# Altium schematic sheet smart.SchDoc
size A0
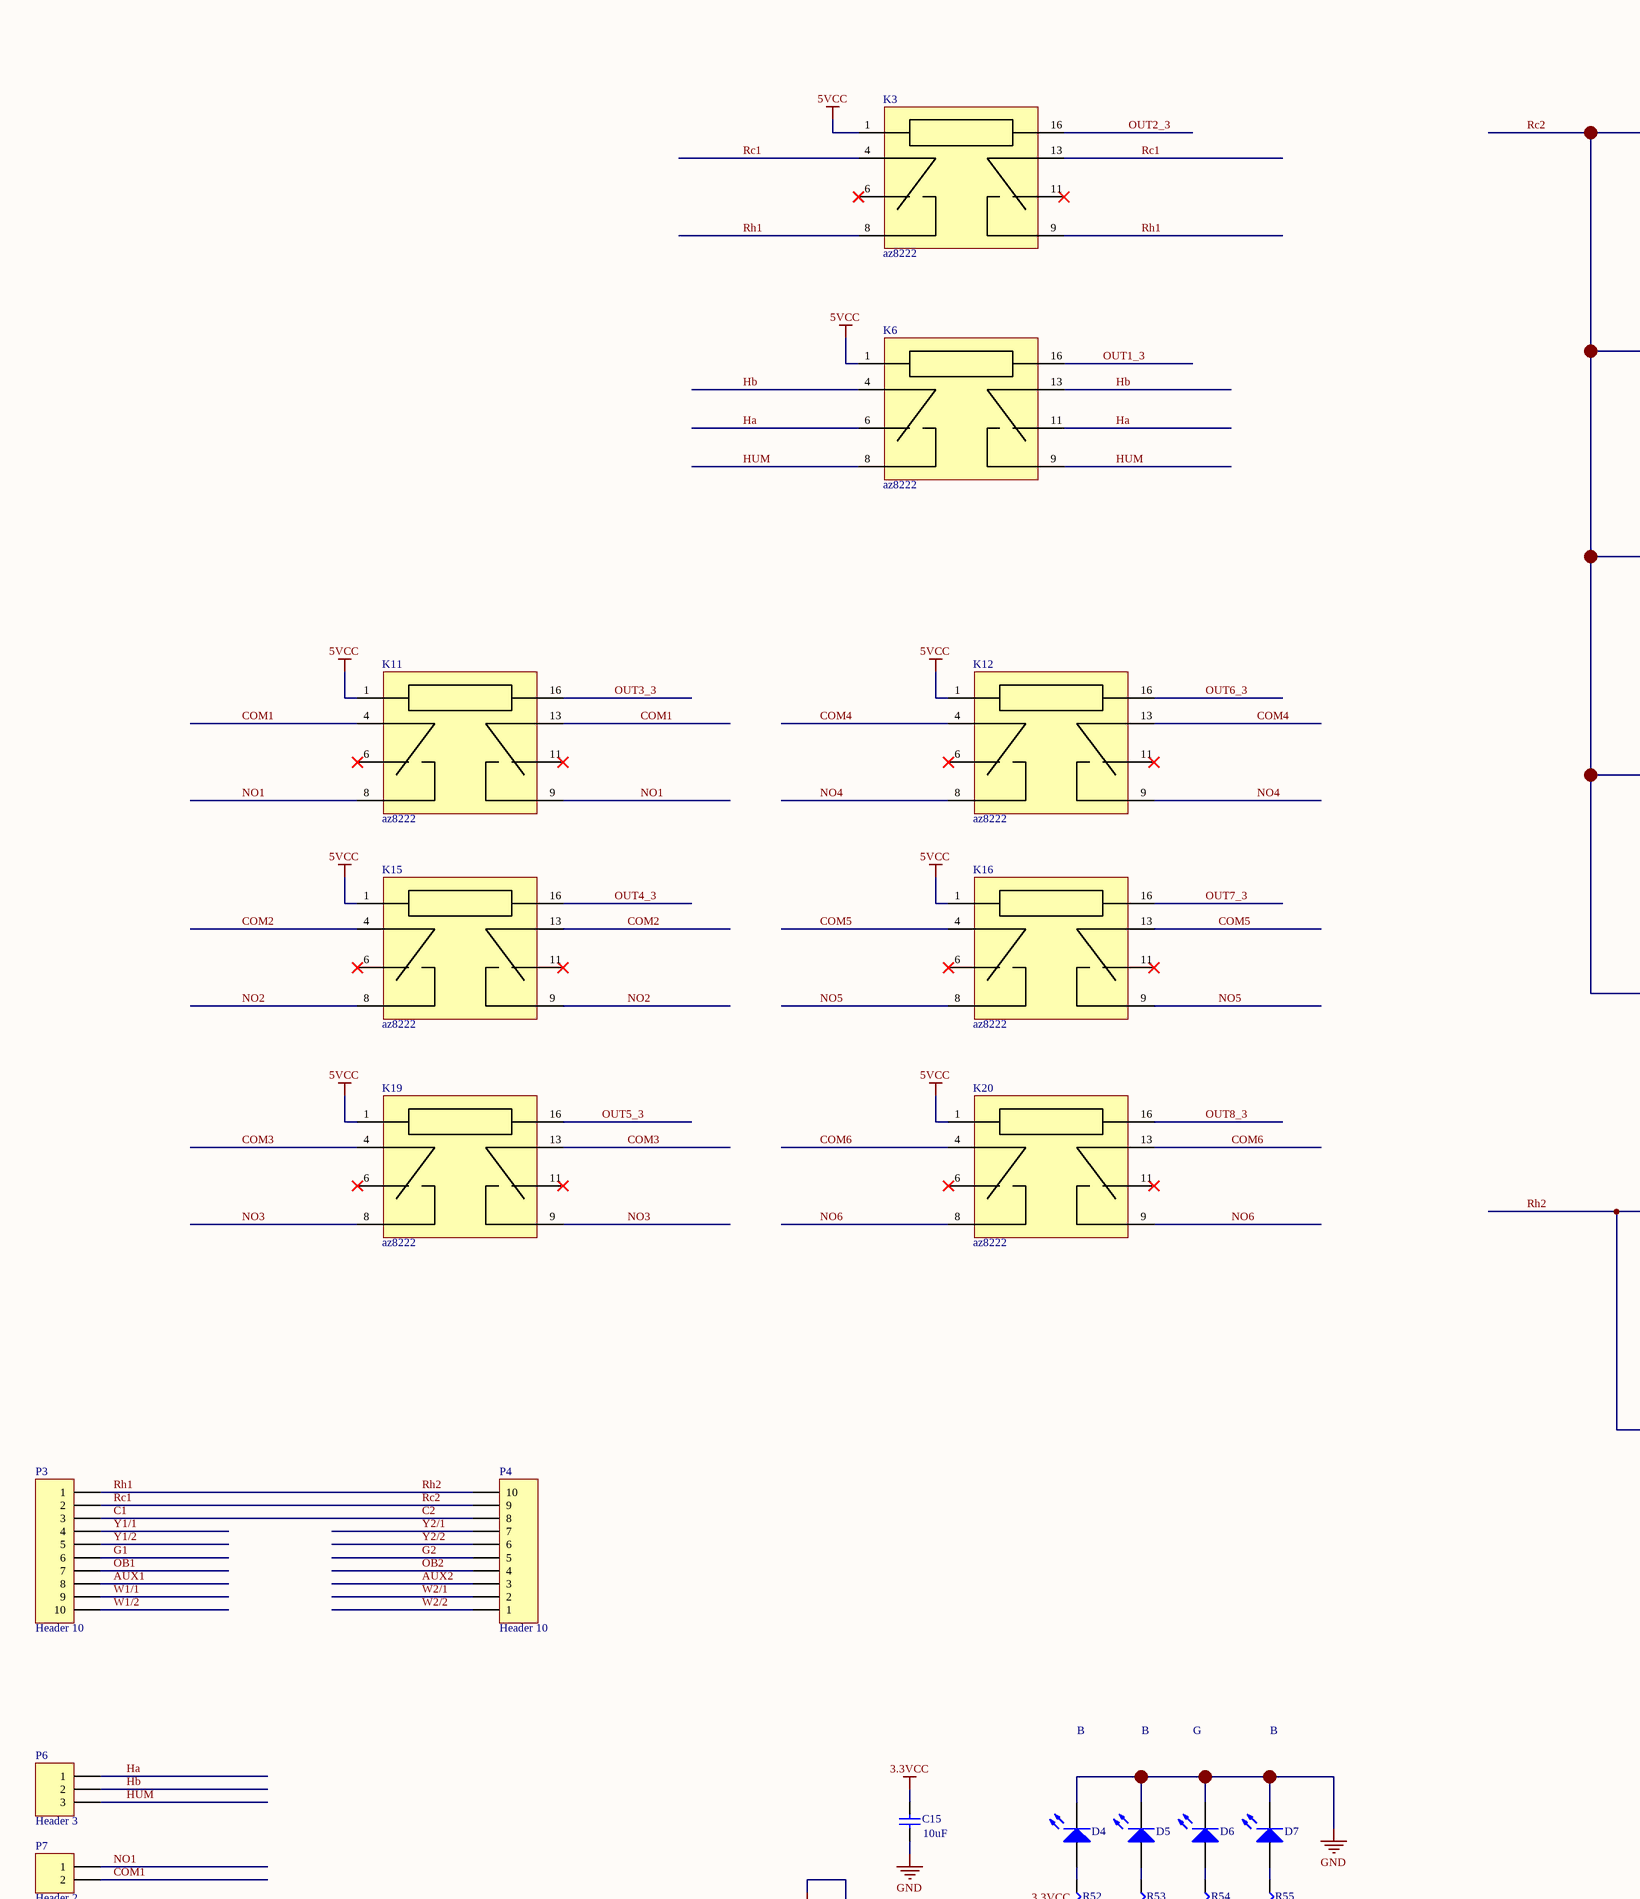
[diagram p0: smart.SchDoc, top left]
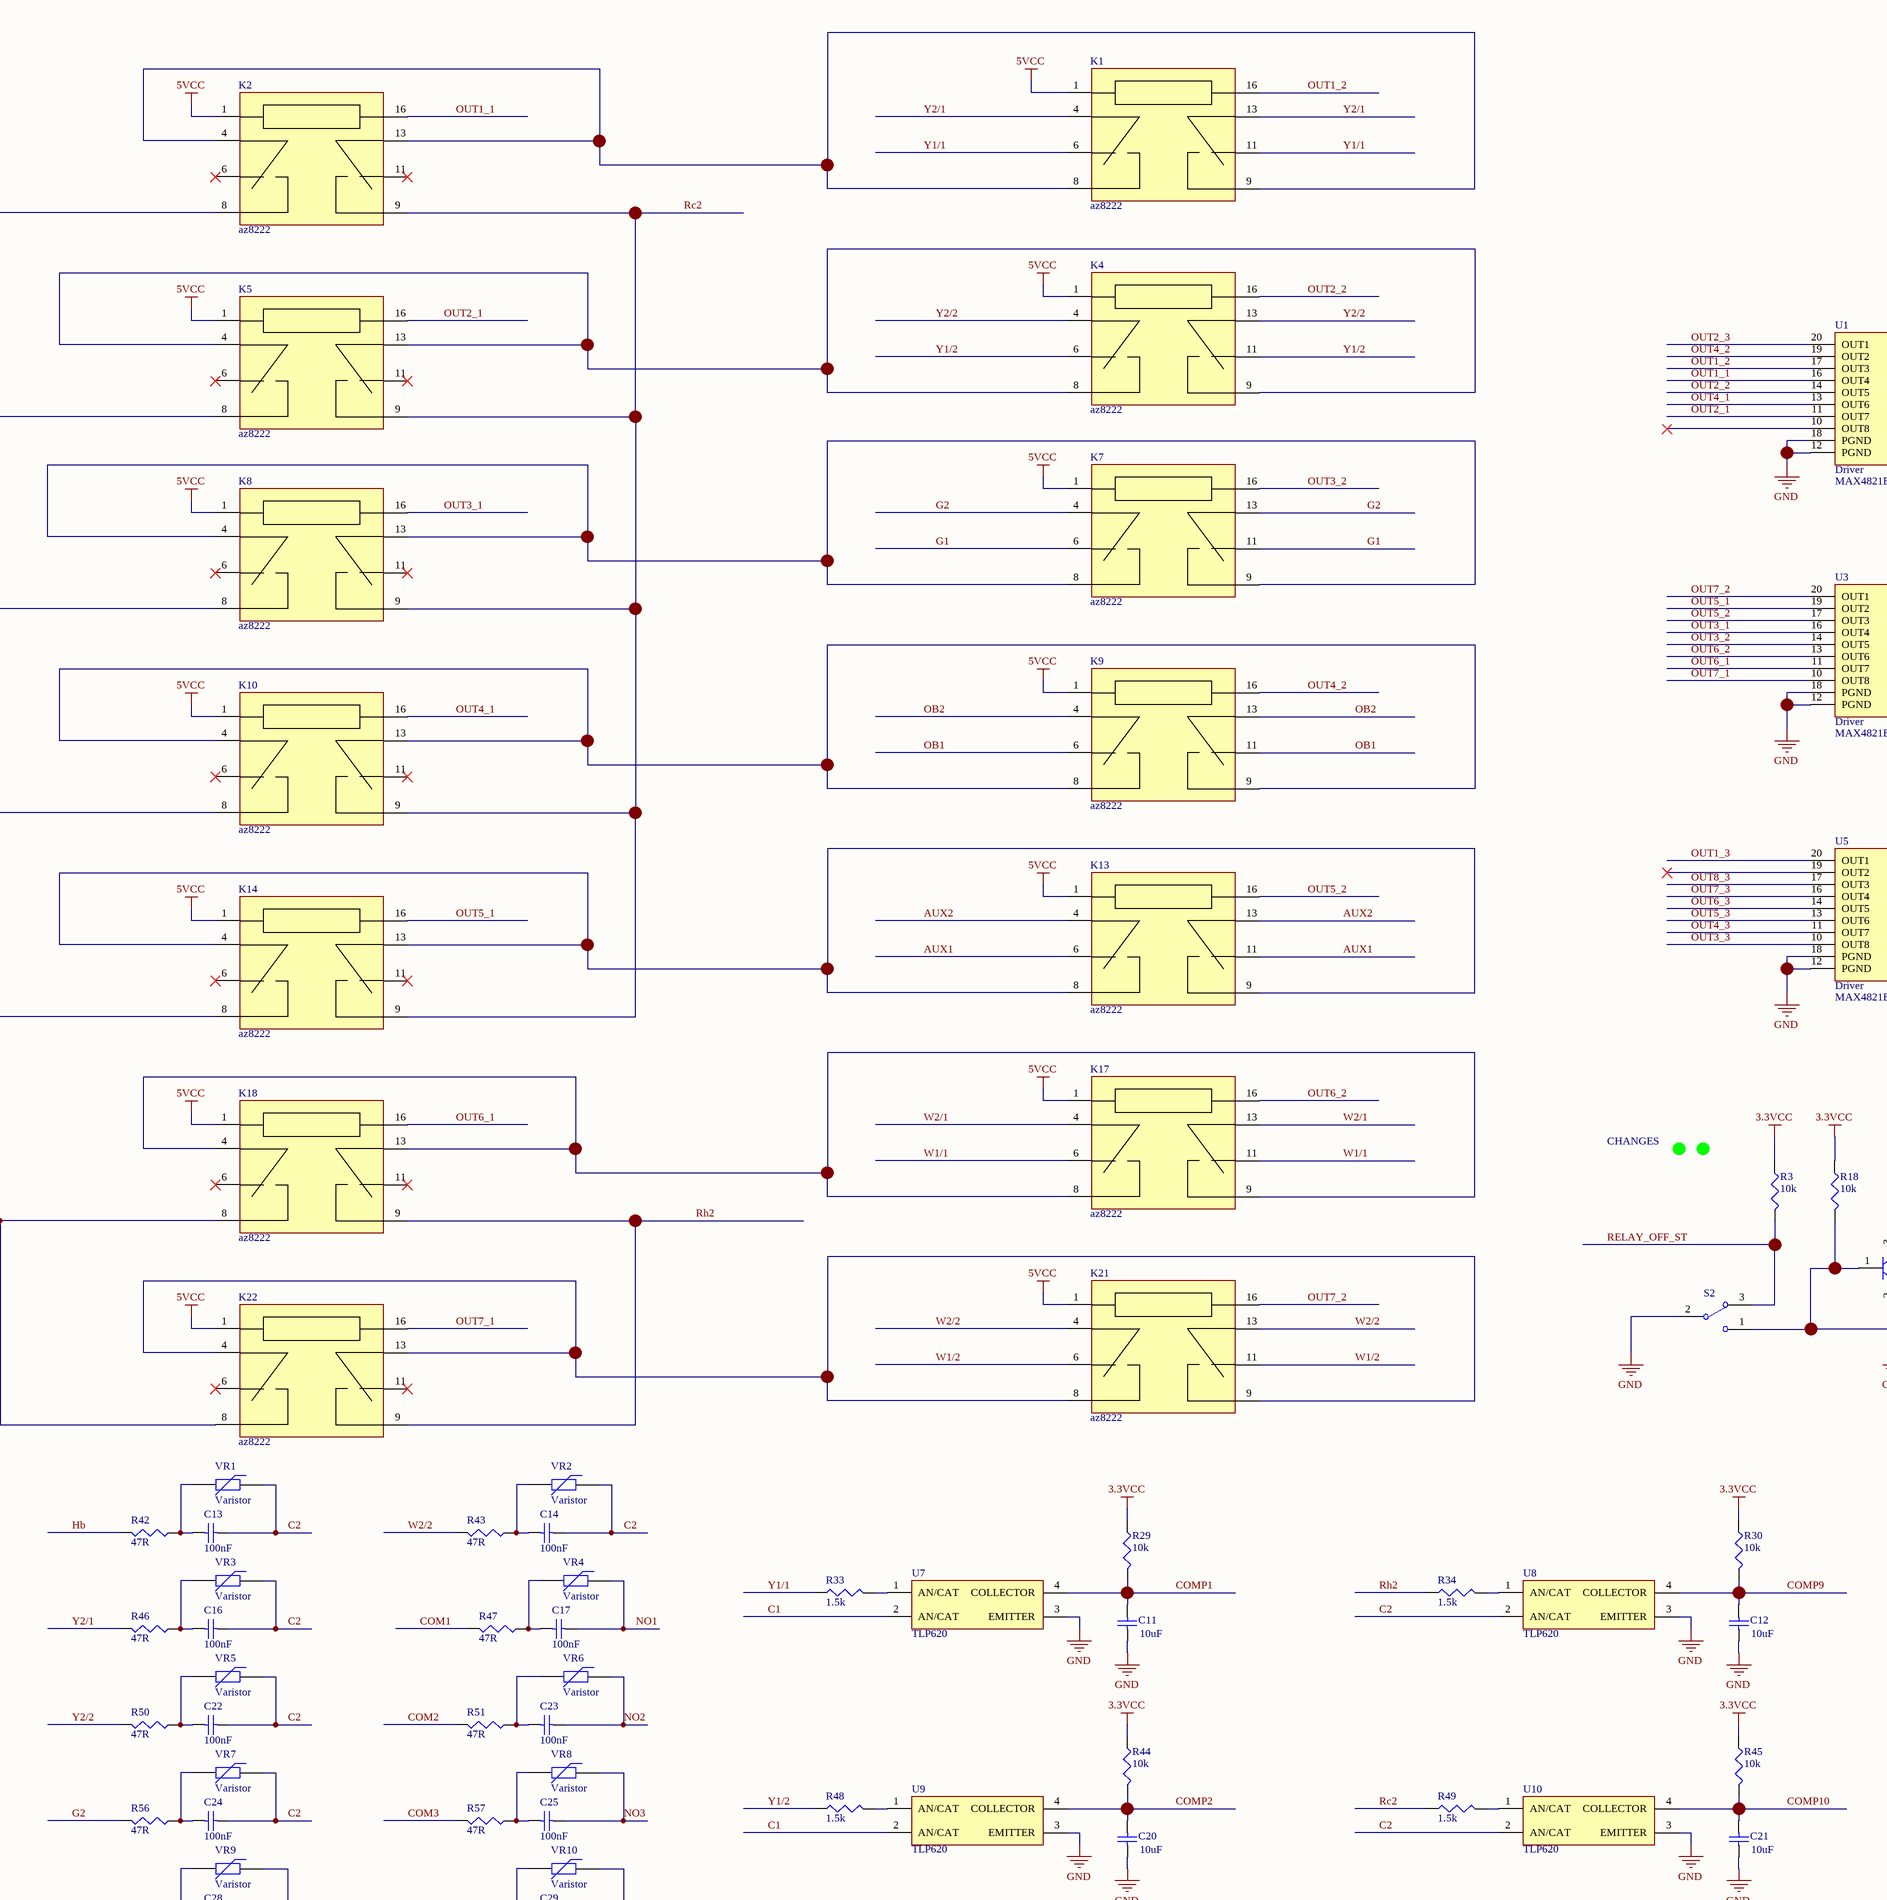
[diagram p1: smart.SchDoc, top middle]
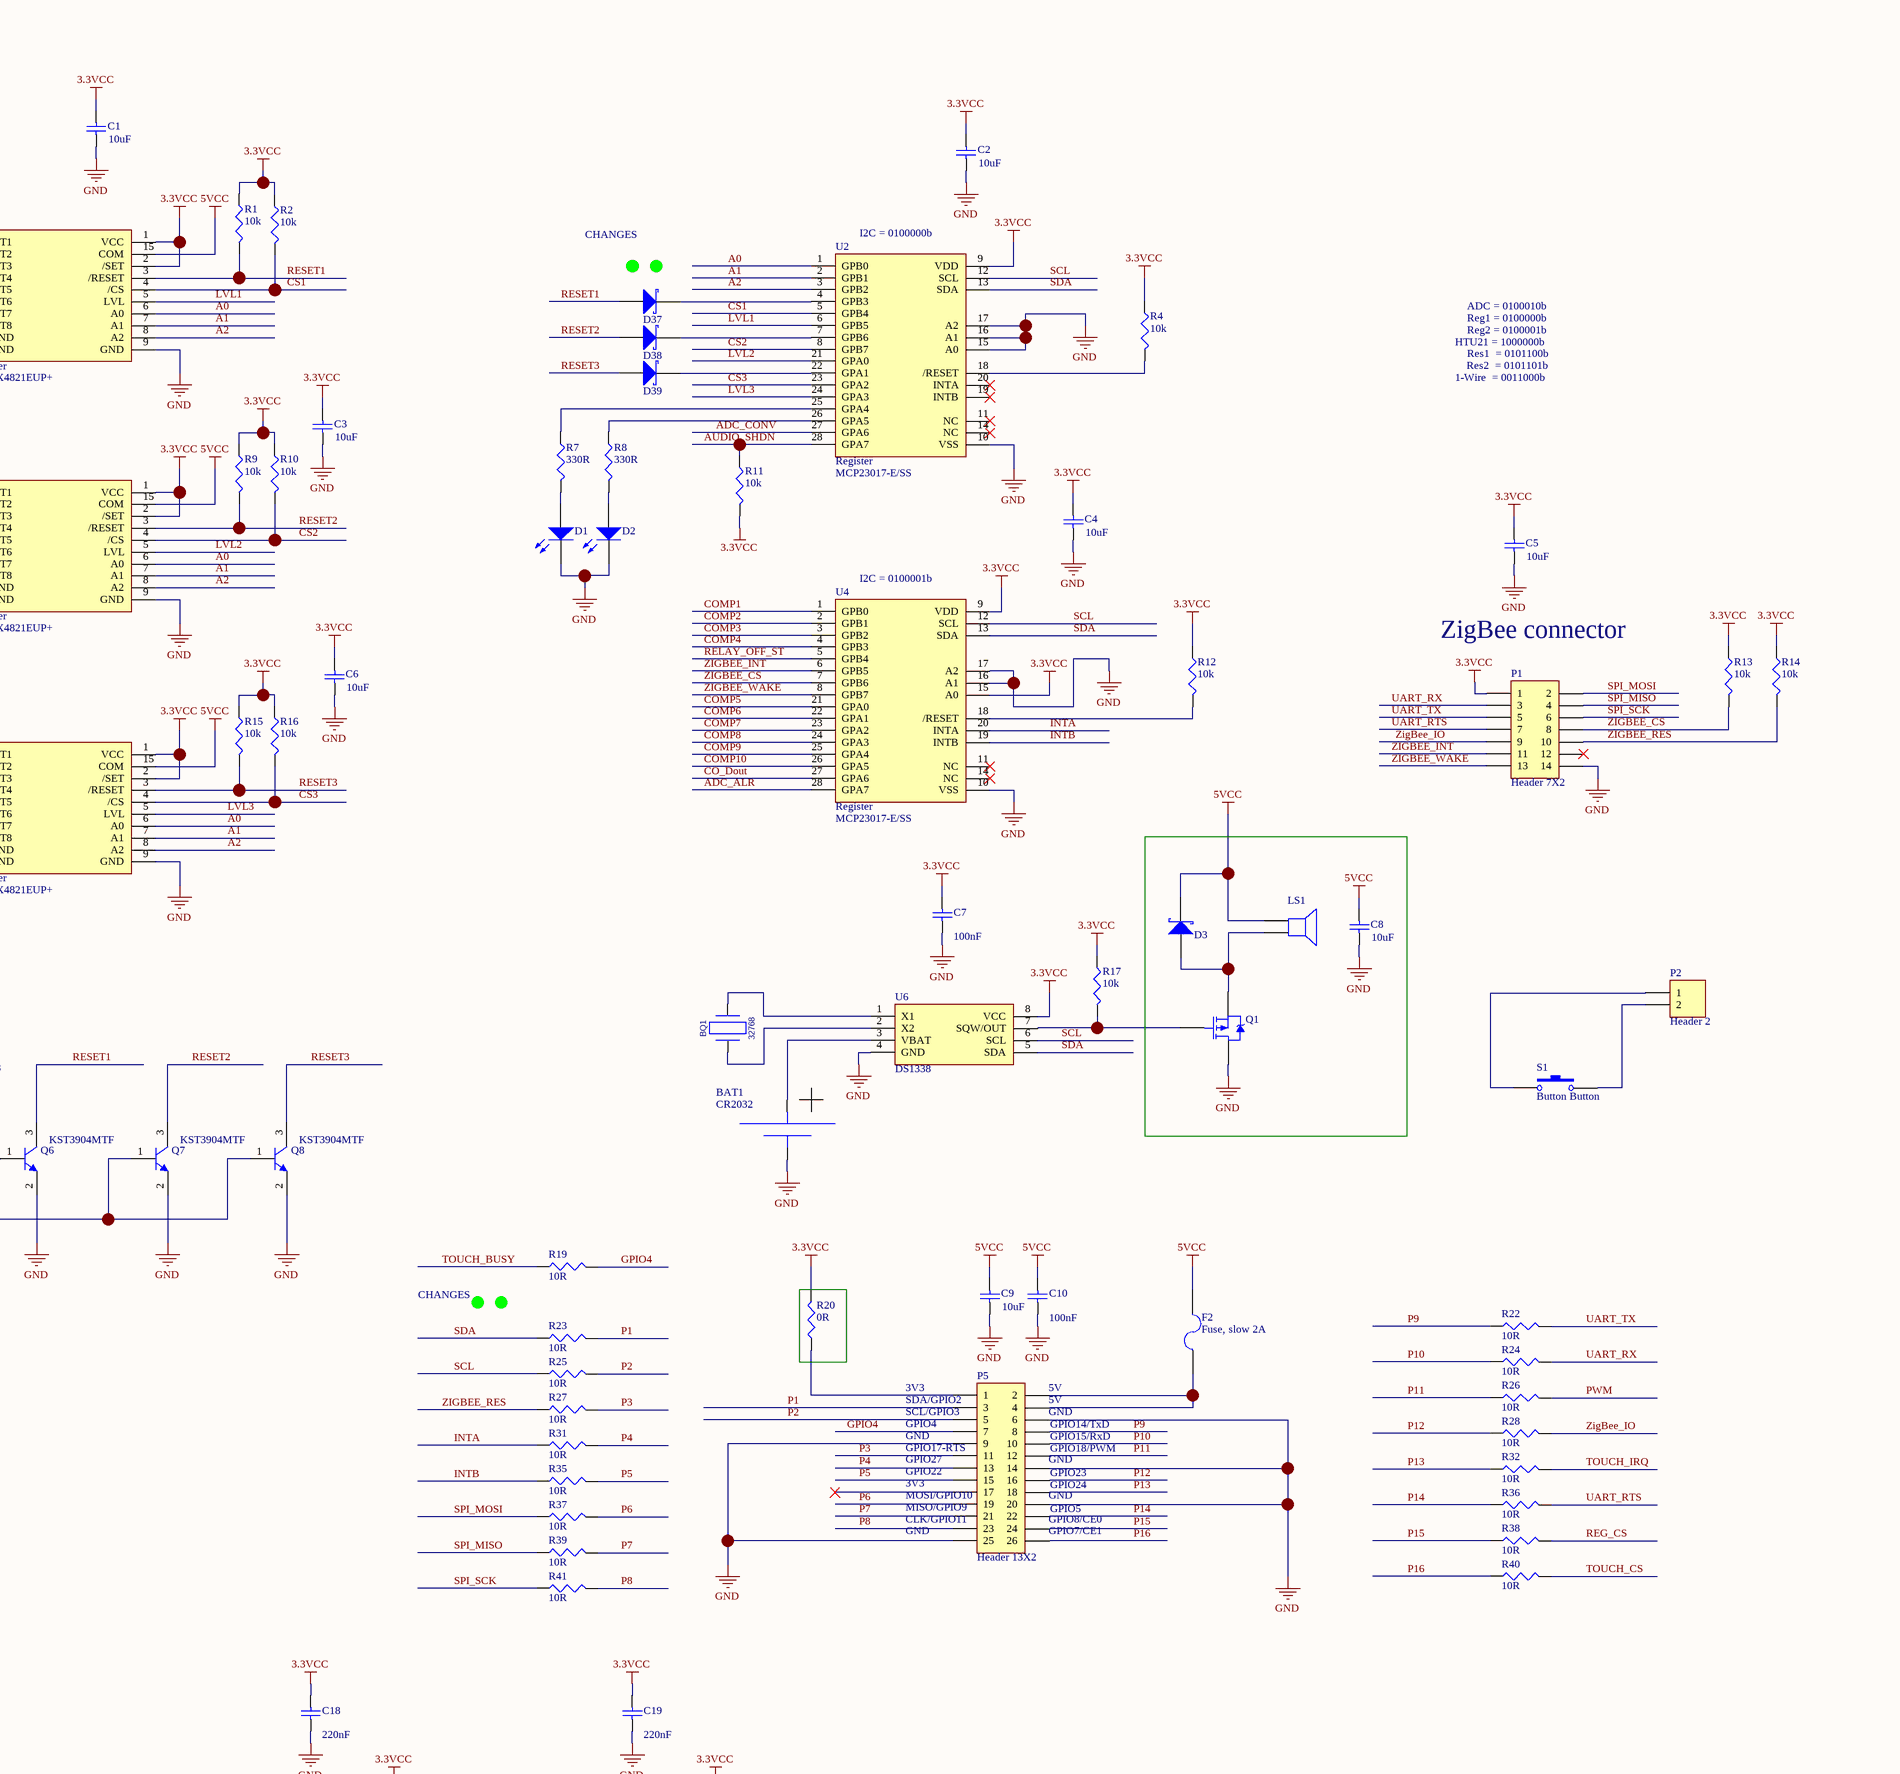
[diagram p2: smart.SchDoc, top right]
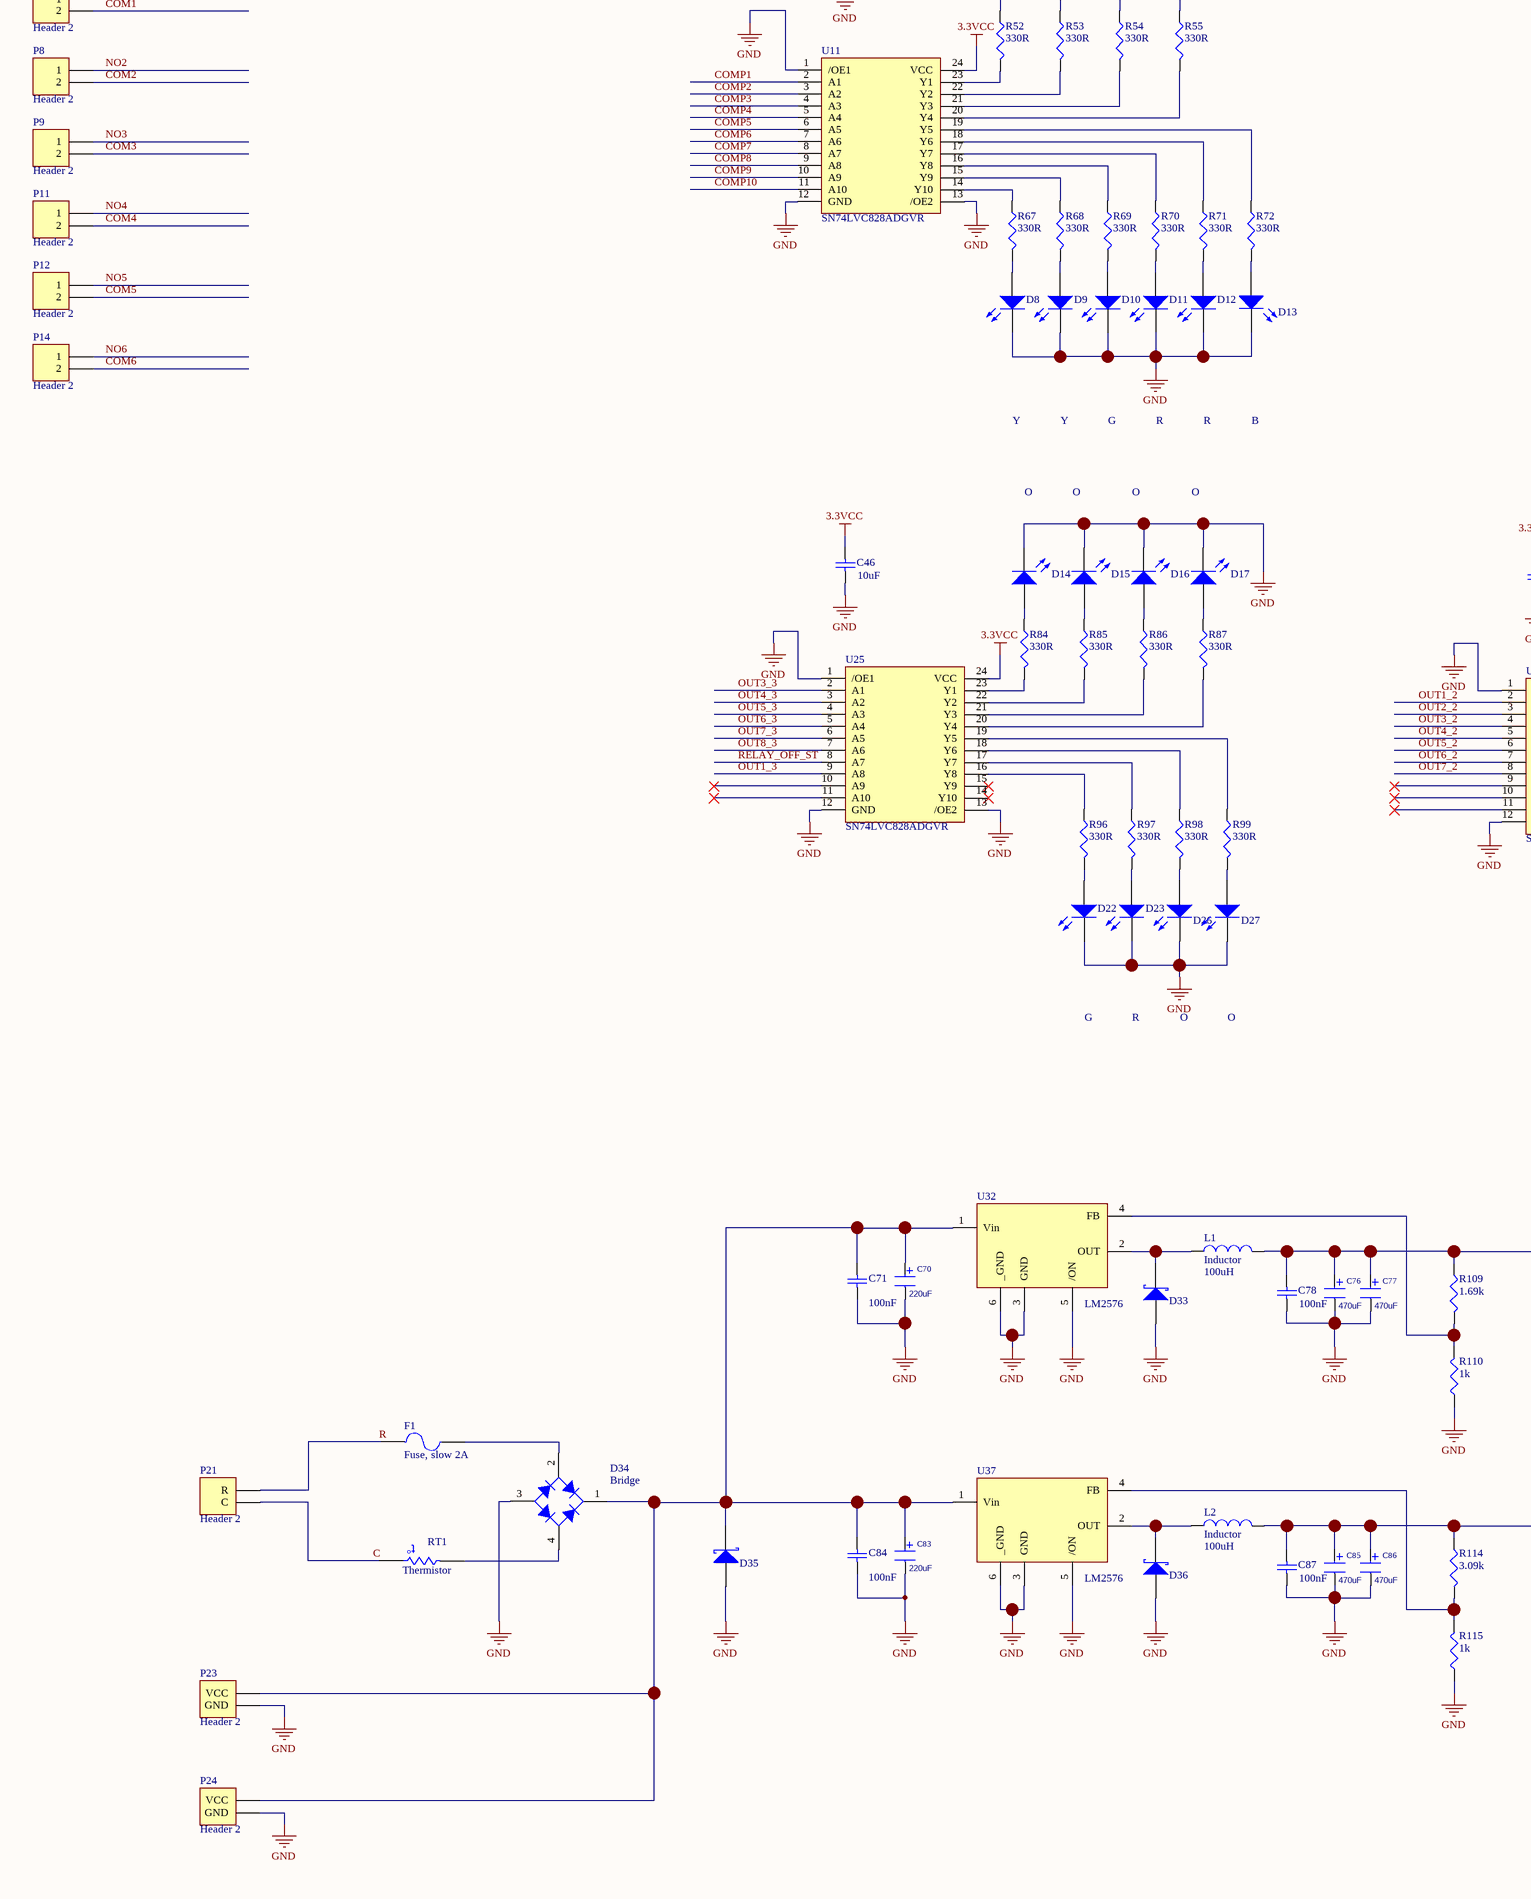
[diagram p3: smart.SchDoc, bottom left]
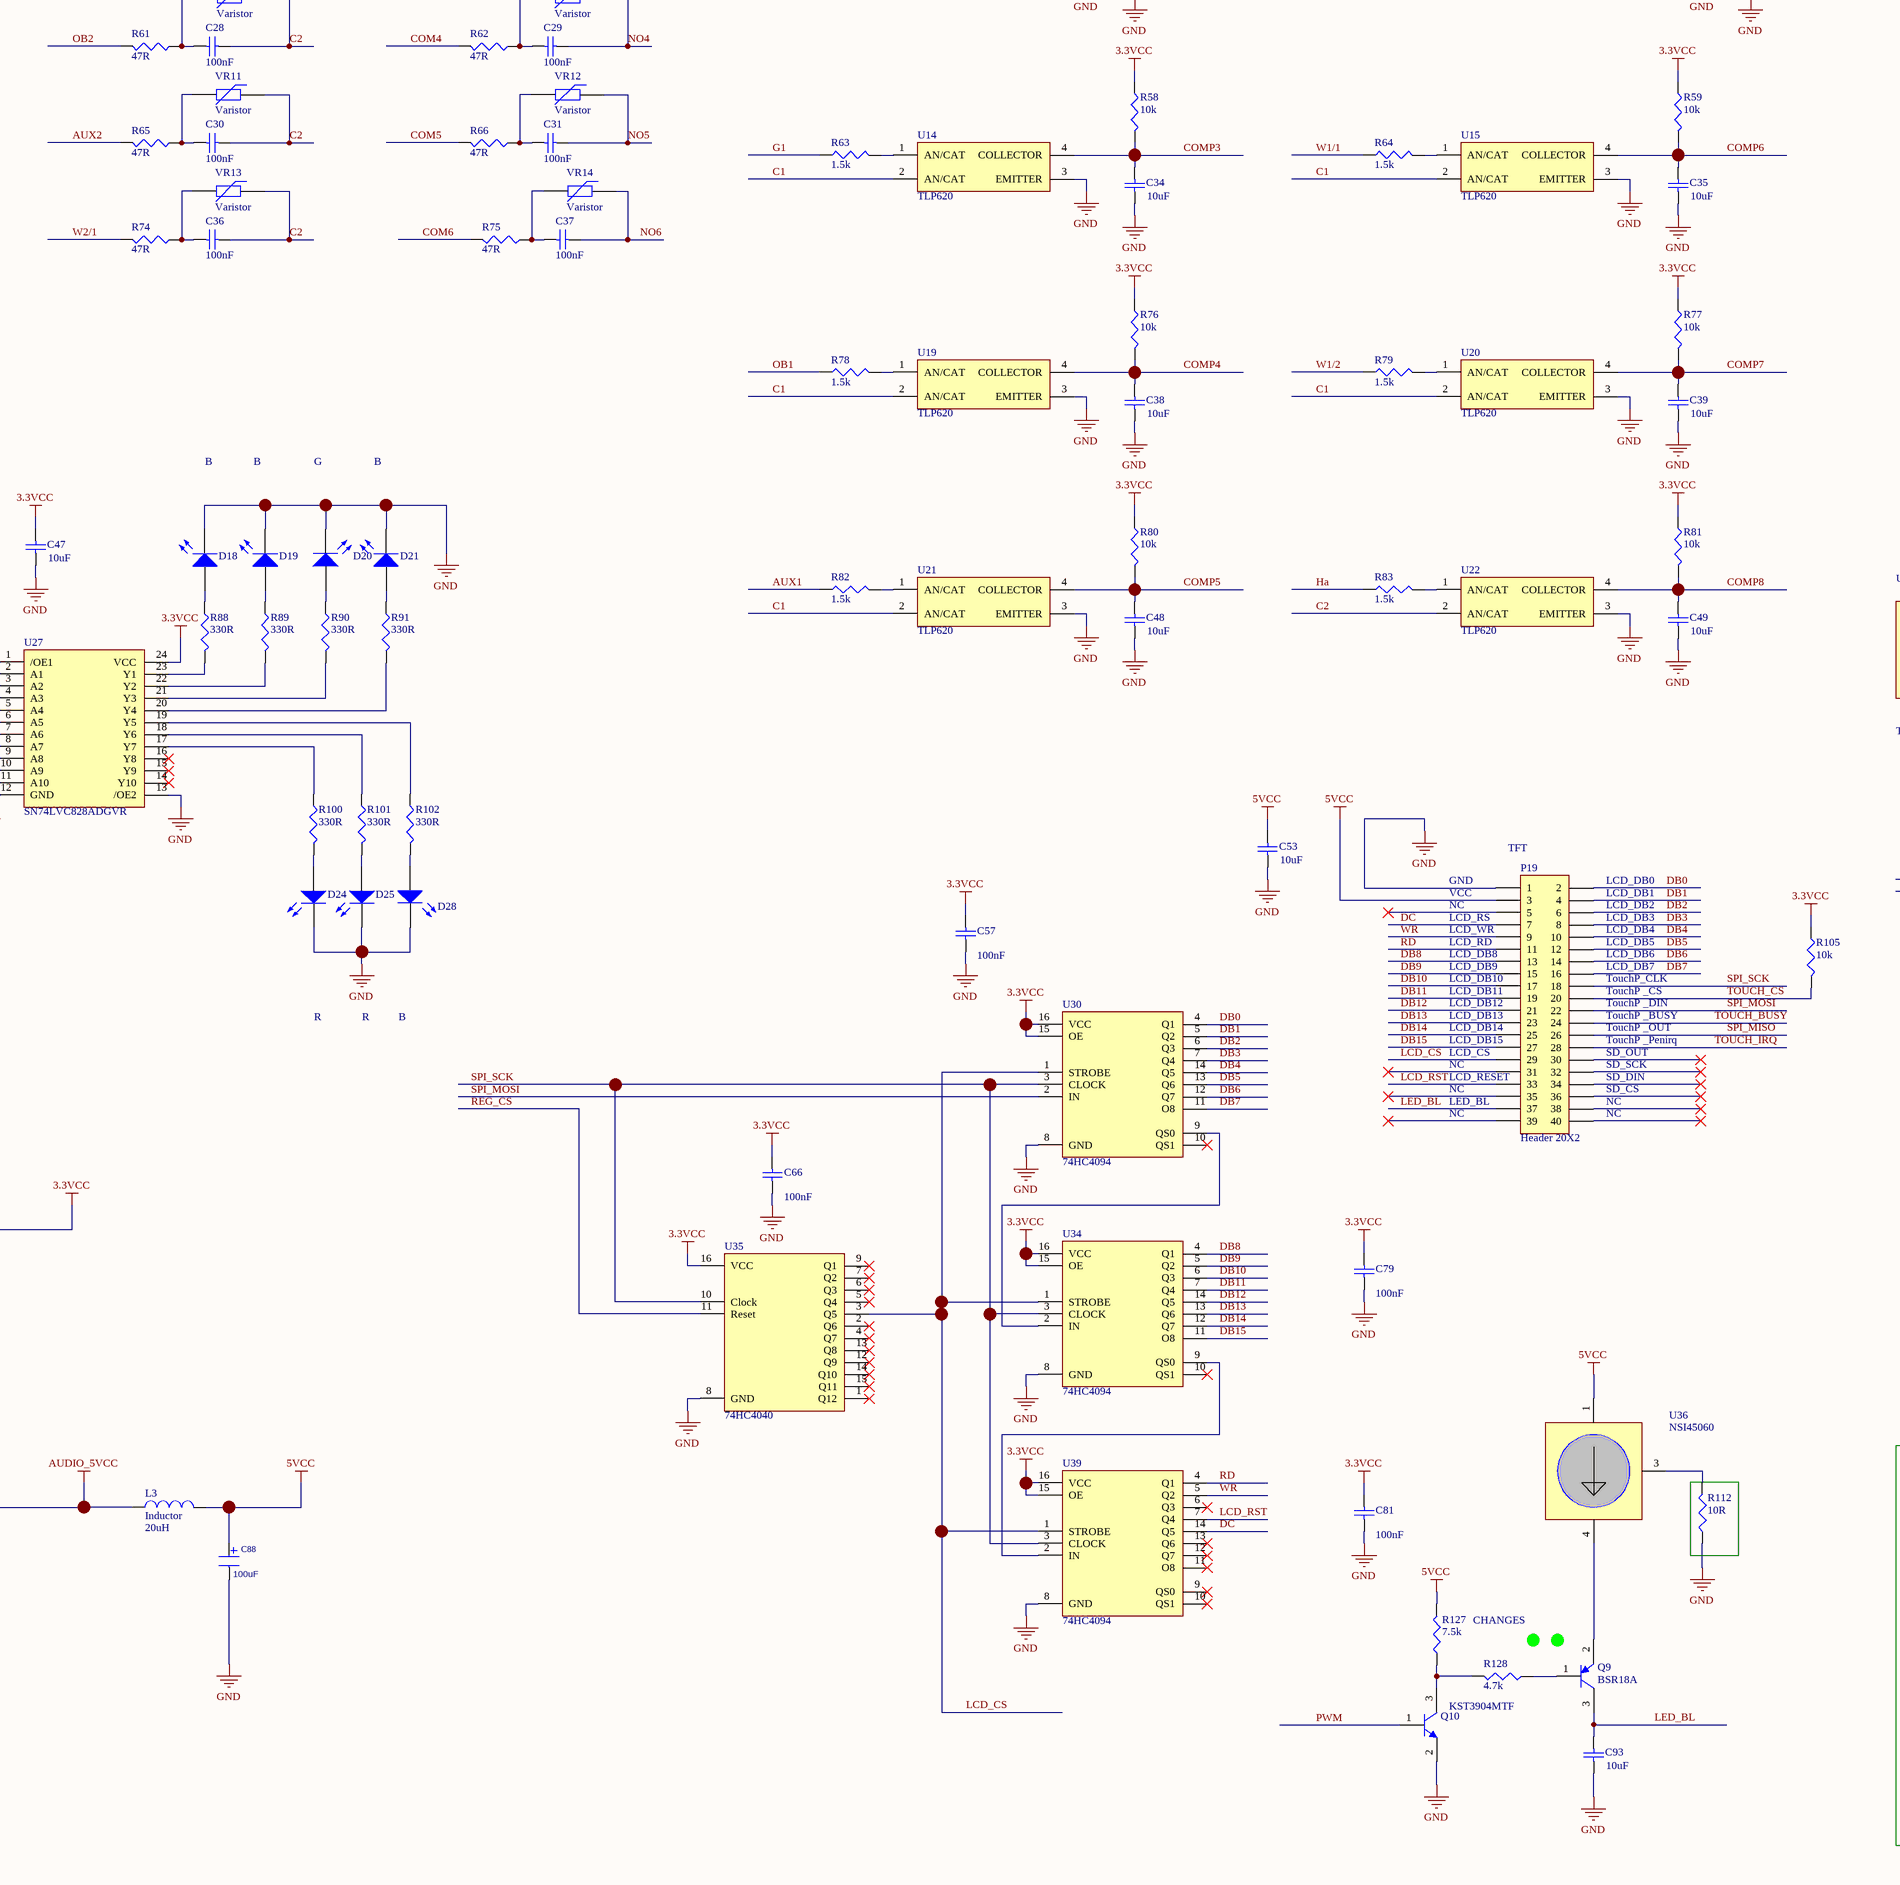
[diagram p4: smart.SchDoc, bottom middle]
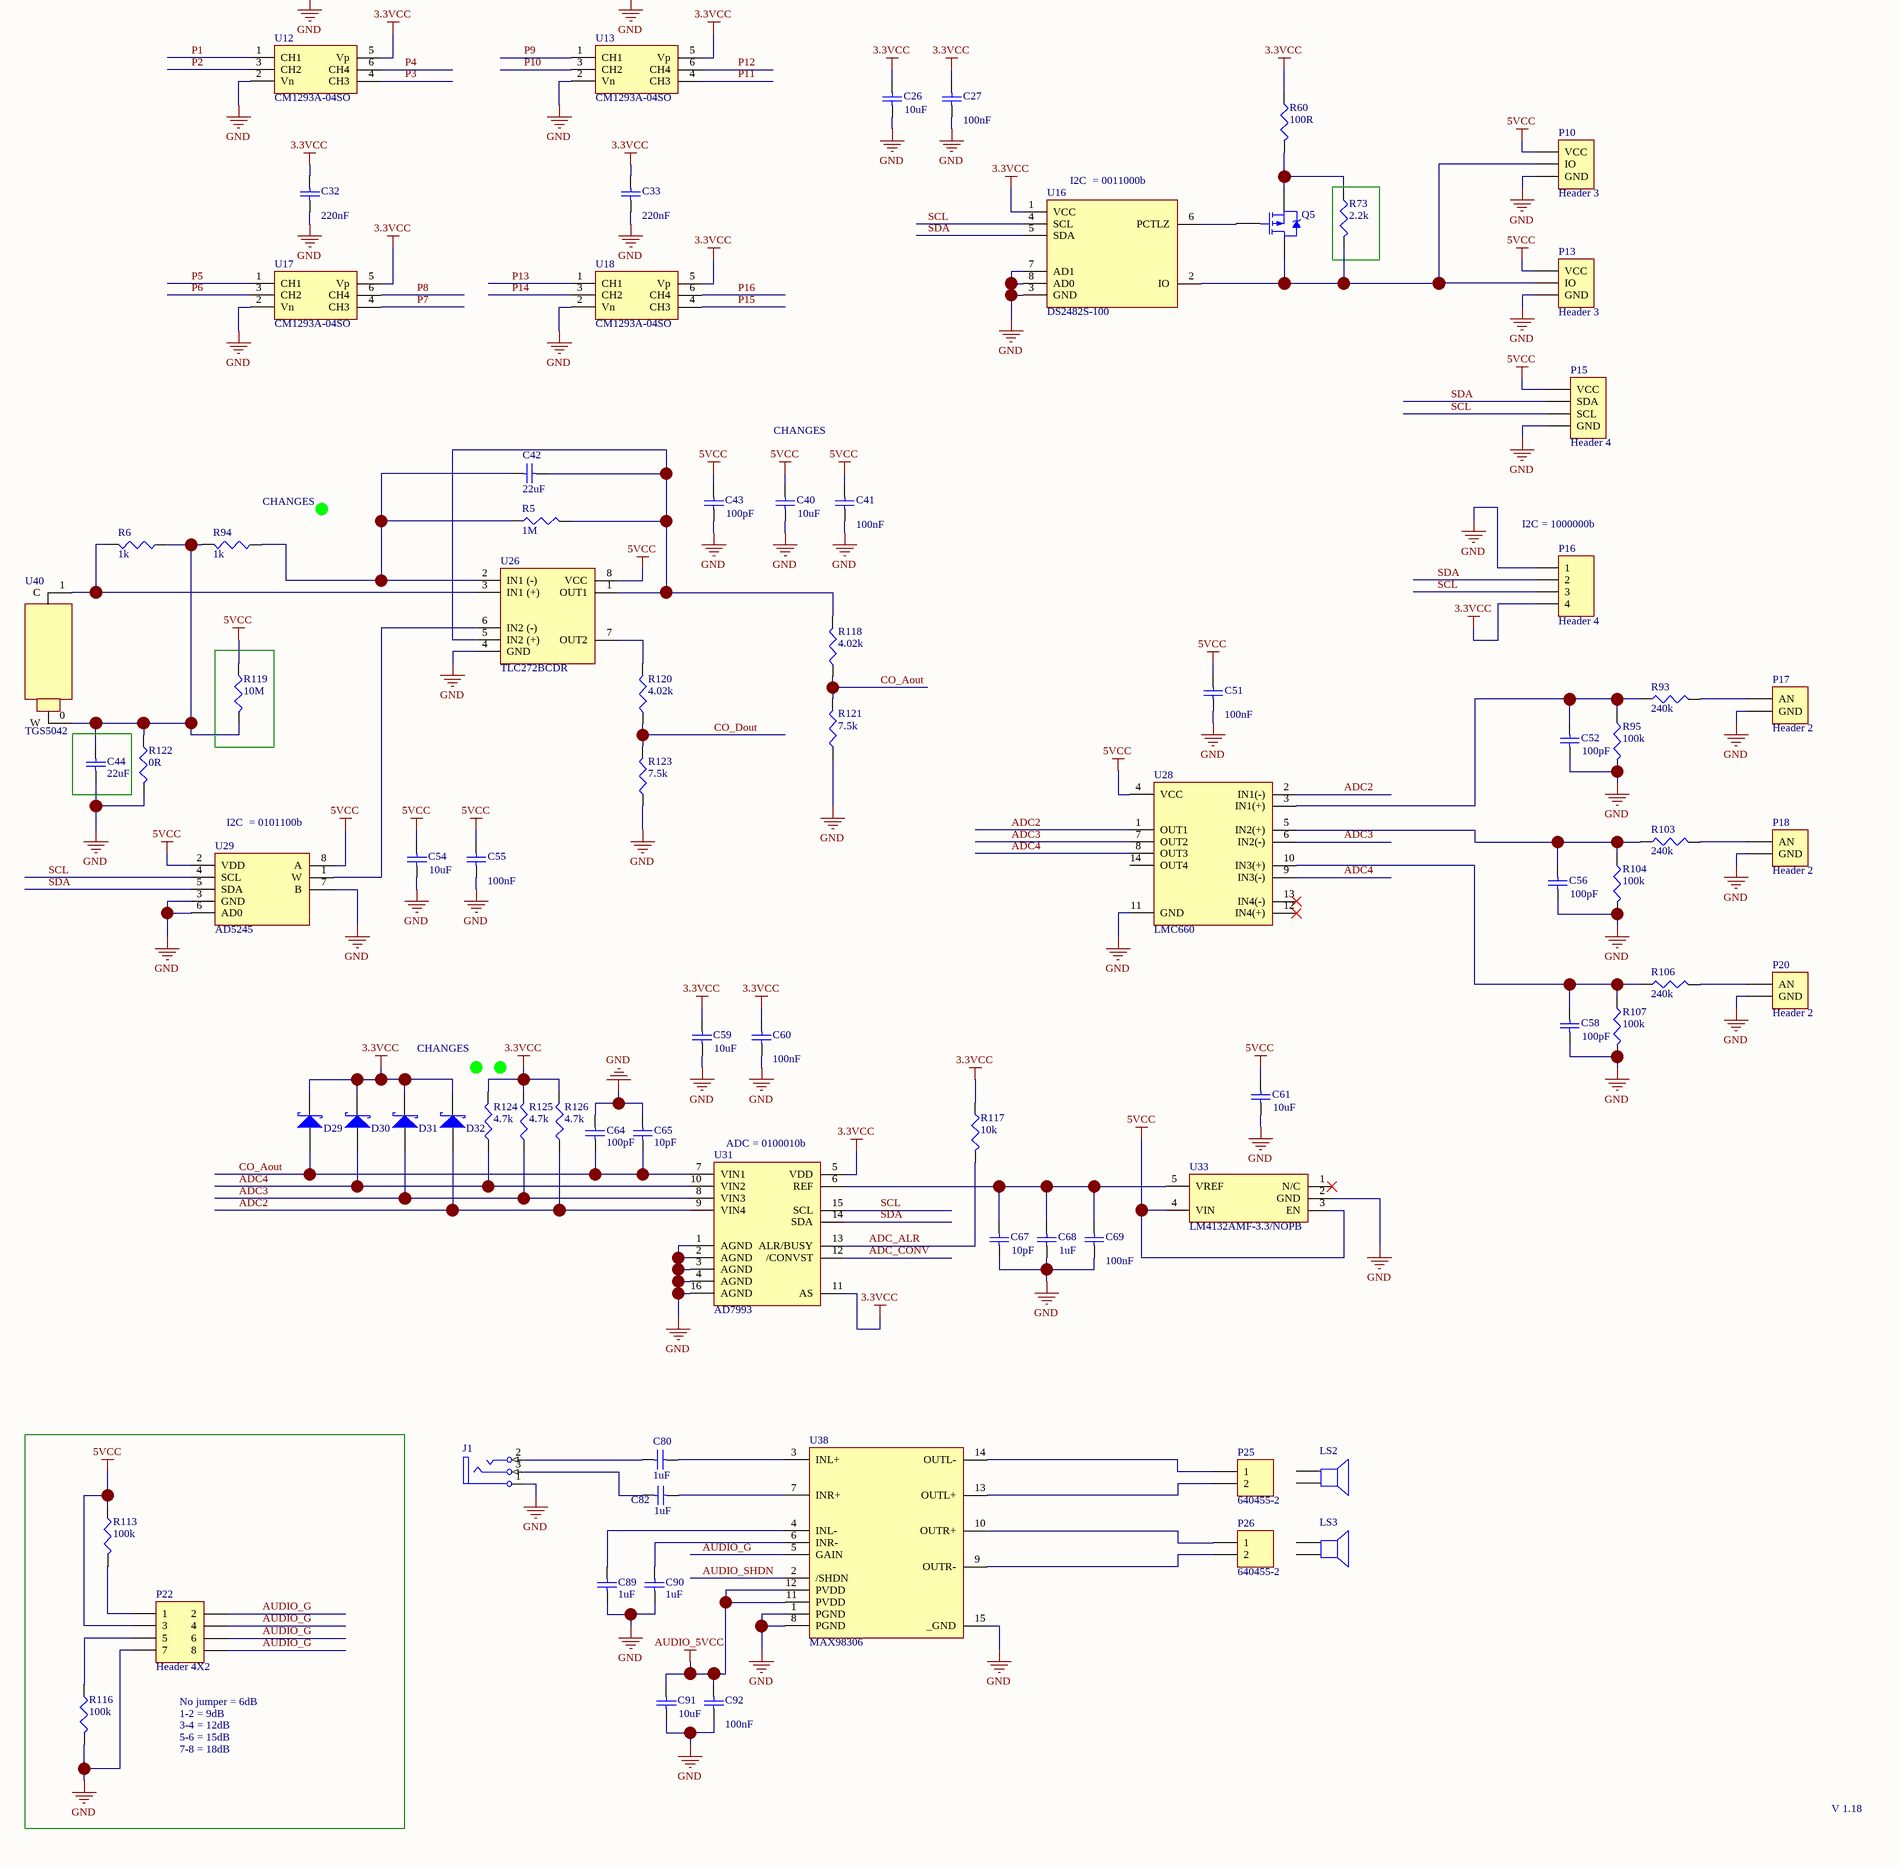
[diagram p5: smart.SchDoc, bottom right]

## Parts
BAT1  CR2032  [BS-3]
BQ1  value 32768  [SOJ4]  (hidden comment: Crystal)
C1  value 10uF  [C0805]  (hidden comment: Capacitor)
C2  value 10uF  [C0805]  (hidden comment: Capacitor)
C3  value 10uF  [C0805]  (hidden comment: Capacitor)
C4  value 10uF  [C0805]  (hidden comment: Capacitor)
C5  value 10uF  [C0805]  (hidden comment: Capacitor)
C6  value 10uF  [C0805]  (hidden comment: Capacitor)
C7  value 100nF  [0603]  (hidden comment: Capacitor)
C8  value 10uF  [C0805]  (hidden comment: Capacitor)
C9  value 10uF  [C0805]  (hidden comment: Capacitor)
C10  value 100nF  [0603]  (hidden comment: Capacitor)
C11  value 10uF  [C0805]  (hidden comment: Capacitor)
C12  value 10uF  [C0805]  (hidden comment: Capacitor)
C13  value 100nF  [B32521C3104K]  (hidden comment: Capacitor)
C14  value 100nF  [B32521C3104K]  (hidden comment: Capacitor)
C15  value 10uF  [C0805]  (hidden comment: Capacitor)
C16  value 100nF  [B32521C3104K]  (hidden comment: Capacitor)
C17  value 100nF  [B32521C3104K]  (hidden comment: Capacitor)
C18  value 220nF  [0603]  (hidden comment: Capacitor)
C19  value 220nF  [0603]  (hidden comment: Capacitor)
C20  value 10uF  [C0805]  (hidden comment: Capacitor)
C21  value 10uF  [C0805]  (hidden comment: Capacitor)
C22  value 100nF  [B32521C3104K]  (hidden comment: Capacitor)
C23  value 100nF  [B32521C3104K]  (hidden comment: Capacitor)
C24  value 100nF  [B32521C3104K]  (hidden comment: Capacitor)
C25  value 100nF  [B32521C3104K]  (hidden comment: Capacitor)
C26  value 10uF  [C0805]  (hidden comment: Capacitor)
C27  value 100nF  [0603]  (hidden comment: Capacitor)
C28  value 100nF  [B32521C3104K]  (hidden comment: Capacitor)
C29  value 100nF  [B32521C3104K]  (hidden comment: Capacitor)
C30  value 100nF  [B32521C3104K]  (hidden comment: Capacitor)
C31  value 100nF  [B32521C3104K]  (hidden comment: Capacitor)
C32  value 220nF  [0603]  (hidden comment: Capacitor)
C33  value 220nF  [0603]  (hidden comment: Capacitor)
C34  value 10uF  [C0805]  (hidden comment: Capacitor)
C35  value 10uF  [C0805]  (hidden comment: Capacitor)
C36  value 100nF  [B32521C3104K]  (hidden comment: Capacitor)
C37  value 100nF  [B32521C3104K]  (hidden comment: Capacitor)
C38  value 10uF  [C0805]  (hidden comment: Capacitor)
C39  value 10uF  [C0805]  (hidden comment: Capacitor)
C40  value 10uF  [C0805]  (hidden comment: Capacitor)
C41  value 100nF  [0603]  (hidden comment: Capacitor)
C42  value 22uF  [0603]  (hidden comment: Capacitor)
C43  value 100pF  [0603]  (hidden comment: Capacitor)
C44  value 22uF  [0603]  (hidden comment: Capacitor)
C46  value 10uF  [C0805]  (hidden comment: Capacitor)
C47  value 10uF  [C0805]  (hidden comment: Capacitor)
C48  value 10uF  [C0805]  (hidden comment: Capacitor)
C49  value 10uF  [C0805]  (hidden comment: Capacitor)
C51  value 100nF  [0603]  (hidden comment: Capacitor)
C52  value 100pF  [0603]  (hidden comment: Capacitor)
C53  value 10uF  [C0805]  (hidden comment: Capacitor)
C54  value 10uF  [C0805]  (hidden comment: Capacitor)
C55  value 100nF  [0603]  (hidden comment: Capacitor)
C56  value 100pF  [0603]  (hidden comment: Capacitor)
C57  value 100nF  [0603]  (hidden comment: Capacitor)
C58  value 100pF  [0603]  (hidden comment: Capacitor)
C59  value 10uF  [C0805]  (hidden comment: Capacitor)
C60  value 100nF  [0603]  (hidden comment: Capacitor)
C61  value 10uF  [C0805]  (hidden comment: Capacitor)
C64  value 100pF  [0603]  (hidden comment: Capacitor)
C65  value 10pF  [0603]  (hidden comment: Capacitor)
C66  value 100nF  [0603]  (hidden comment: Capacitor)
C67  value 10pF  [0603]  (hidden comment: Capacitor)
C68  value 1uF  [0603]  (hidden comment: Capacitor)
C69  value 100nF  [0603]  (hidden comment: Capacitor)
C70  220uF  [UUR1H330MCL1GS]
C71  value 100nF  [1206]  (hidden comment: Capacitor)
C76  470uF  [UUR1H330MCL1GS]
C77  470uF  [UUR1H330MCL1GS]
C78  value 100nF  [0603]  (hidden comment: Capacitor)
C79  value 100nF  [0603]  (hidden comment: Capacitor)
C80  value 1uF  [0603]  (hidden comment: Capacitor)
C81  value 100nF  [0603]  (hidden comment: Capacitor)
C82  value 1uF  [0603]  (hidden comment: Capacitor)
C83  220uF  [UUR1H330MCL1GS]
C84  value 100nF  [1206]  (hidden comment: Capacitor)
C85  470uF  [UUR1H330MCL1GS]
C86  470uF  [UUR1H330MCL1GS]
C87  value 100nF  [0603]  (hidden comment: Capacitor)
C88  100uF  [UUR1H330MCL1GS]
C89  value 1uF  [0603]  (hidden comment: Capacitor)
C90  value 1uF  [0603]  (hidden comment: Capacitor)
C91  value 10uF  [C0805]  (hidden comment: Capacitor)
C92  value 100nF  [0603]  (hidden comment: Capacitor)
C93  value 10uF  [C0805]  (hidden comment: Capacitor)
D1  Led  [LED0603]  (value not drawn)
D2  Led  [LED0603]  (value not drawn)
D3  Diode  [D1206]  (value not drawn)
D4  Led  [LED0603]  (value not drawn)
D5  Led  [LED0603]  (value not drawn)
D6  Led  [LED0603]  (value not drawn)
D7  Led  [LED0603]  (value not drawn)
D8  Led  [LED0603]  (value not drawn)
D9  Led  [LED0603]  (value not drawn)
D10  Led  [LED0603]  (value not drawn)
D11  Led  [LED0603]  (value not drawn)
D12  Led  [LED0603]  (value not drawn)
D13  Led  [LED0603]  (value not drawn)
D14  Led  [LED0603]  (value not drawn)
D15  Led  [LED0603]  (value not drawn)
D16  Led  [LED0603]  (value not drawn)
D17  Led  [LED0603]  (value not drawn)
D18  Led  [LED0603]  (value not drawn)
D19  Led  [LED0603]  (value not drawn)
D20  Led  [LED0603]  (value not drawn)
D21  Led  [LED0603]  (value not drawn)
D22  Led  [LED0603]  (value not drawn)
D23  Led  [LED0603]  (value not drawn)
D24  Led  [LED0603]  (value not drawn)
D25  Led  [LED0603]  (value not drawn)
D26  Led  [LED0603]  (value not drawn)
D27  Led  [LED0603]  (value not drawn)
D28  Led  [LED0603]  (value not drawn)
D29  Diode  [D1206]  (value not drawn)
D30  Diode  [D1206]  (value not drawn)
D31  Diode  [D1206]  (value not drawn)
D32  Diode  [D1206]  (value not drawn)
D33  Diode  [D1206]  (value not drawn)
D34  Bridge  [CDBHM2100L-HF]
D35  Suppressor  [DO214AA]  (value not drawn)
D36  Diode  [D1206]  (value not drawn)
D37  Diode  [D0603]  (value not drawn)
D38  Diode  [D0603]  (value not drawn)
D39  Diode  [D0603]  (value not drawn)
F1  Fuse, slow 2A  [C1206]
F2  Fuse, slow 2A  [C1206]
J1  Phonejack3  [audio]  (value not drawn)
K1  az8222  [az8222]
K2  az8222  [az8222]
K3  az8222  [az8222]
K4  az8222  [az8222]
K5  az8222  [az8222]
K6  az8222  [az8222]
K7  az8222  [az8222]
K8  az8222  [az8222]
K9  az8222  [az8222]
K10  az8222  [az8222]
K11  az8222  [az8222]
K12  az8222  [az8222]
K13  az8222  [az8222]
K14  az8222  [az8222]
K15  az8222  [az8222]
K16  az8222  [az8222]
K17  az8222  [az8222]
K18  az8222  [az8222]
K19  az8222  [az8222]
K20  az8222  [az8222]
K21  az8222  [az8222]
K22  az8222  [az8222]
L1  Inductor  value 100uH  [KM_4]
L2  Inductor  value 100uH  [KM_4]
L3  Inductor  value 20uH  [IND22]
LS1  Speaker  [CEP2242]  (value not drawn)
LS2  Speaker  [AS02808MR]  (value not drawn)
LS3  Speaker  [AS02808MR]  (value not drawn)
P1  Header 7X2  [JTAG14]
P2  Header 2  [HDR1X2]
P3  Header 10  [10pin_socket]
P4  Header 10  [10pin_socket]
P5  Header 13X2  [HDR2X13]
P6  Header 3  [3pin_socket]
P7  Header 2  [2pin_socket]
P8  Header 2  [2pin_socket]
P9  Header 2  [2pin_socket]
P10  Header 3  [RJ11]
P11  Header 2  [2pin_socket]
P12  Header 2  [2pin_socket]
P13  Header 3  [RJ11]
P14  Header 2  [2pin_socket]
P15  Header 4  [RJ11]
P16  Header 4  [GRPB041VWCN_RC]
P17  Header 2  [2pin_socket]
P18  Header 2  [2pin_socket]
P19  Header 20X2  [CON40]
P20  Header 2  [2pin_socket]
P21  Header 2  [2pin_socket]
P22  Header 4X2  [CON8]
P23  Header 2  [2pin_socket]
P24  Header 2  [2pin_socket]
P25  Manufacturer Part Number: 640455-2  [BAT_CON]  (hidden comment: Connector)
P26  Manufacturer Part Number: 640455-2  [BAT_CON]  (hidden comment: Connector)
Q1  IRLML6302GTRPBF  [SOT-23_N]  (value not drawn)
Q5  IRLML6302GTRPBF  [SOT-23_N]  (value not drawn)
Q6  KST3904MTF  [SOT-23_N]
Q7  KST3904MTF  [SOT-23_N]
Q8  KST3904MTF  [SOT-23_N]
Q9  BSR18A  [SOT-23_N]
Q10  KST3904MTF  [SOT-23_N]
R1  value 10k  [0603]  (hidden comment: Resistor)
R2  value 10k  [0603]  (hidden comment: Resistor)
R3  value 10k  [0603]  (hidden comment: Resistor)
R4  value 10k  [0603]  (hidden comment: Resistor)
R5  value 1M  [0603]  (hidden comment: Resistor)
R6  value 1k  [0603]  (hidden comment: Resistor)
R7  value 330R  [0603]  (hidden comment: Res)
R8  value 330R  [0603]  (hidden comment: Res)
R9  value 10k  [0603]  (hidden comment: Resistor)
R10  value 10k  [0603]  (hidden comment: Resistor)
R11  value 10k  [0603]  (hidden comment: Resistor)
R12  value 10k  [0603]  (hidden comment: Resistor)
R13  value 10k  [0603]  (hidden comment: Resistor)
R14  value 10k  [0603]  (hidden comment: Resistor)
R15  value 10k  [0603]  (hidden comment: Resistor)
R16  value 10k  [0603]  (hidden comment: Resistor)
R17  value 10k  [0603]  (hidden comment: Resistor)
R18  value 10k  [0603]  (hidden comment: Resistor)
R19  value 10R  [6-0805_L]  (hidden comment: Res)
R20  value 0R  [1206]  (hidden comment: Res)
R22  value 10R  [6-0805_L]  (hidden comment: Res)
R23  value 10R  [6-0805_L]  (hidden comment: Res)
R24  value 10R  [6-0805_L]  (hidden comment: Res)
R25  value 10R  [6-0805_L]  (hidden comment: Res)
R26  value 10R  [6-0805_L]  (hidden comment: Res)
R27  value 10R  [6-0805_L]  (hidden comment: Res)
R28  value 10R  [6-0805_L]  (hidden comment: Res)
R29  value 10k  [0603]  (hidden comment: Resistor)
R30  value 10k  [0603]  (hidden comment: Resistor)
R31  value 10R  [6-0805_L]  (hidden comment: Res)
R32  value 10R  [6-0805_L]  (hidden comment: Res)
R33  value 1.5k  [1206]  (hidden comment: Resistor)
R34  value 1.5k  [1206]  (hidden comment: Resistor)
R35  value 10R  [6-0805_L]  (hidden comment: Res)
R36  value 10R  [6-0805_L]  (hidden comment: Res)
R37  value 10R  [6-0805_L]  (hidden comment: Res)
R38  value 10R  [6-0805_L]  (hidden comment: Res)
R39  value 10R  [6-0805_L]  (hidden comment: Res)
R40  value 10R  [6-0805_L]  (hidden comment: Res)
R41  value 10R  [6-0805_L]  (hidden comment: Res)
R42  value 47R  [RESMELF3614N]  (hidden comment: Res)
R43  value 47R  [RESMELF3614N]  (hidden comment: Res)
R44  value 10k  [0603]  (hidden comment: Resistor)
R45  value 10k  [0603]  (hidden comment: Resistor)
R46  value 47R  [RESMELF3614N]  (hidden comment: Res)
R47  value 47R  [RESMELF3614N]  (hidden comment: Res)
R48  value 1.5k  [1206]  (hidden comment: Resistor)
R49  value 1.5k  [1206]  (hidden comment: Resistor)
R50  value 47R  [RESMELF3614N]  (hidden comment: Res)
R51  value 47R  [RESMELF3614N]  (hidden comment: Res)
R52  value 330R  [0603]  (hidden comment: Res)
R53  value 330R  [0603]  (hidden comment: Res)
R54  value 330R  [0603]  (hidden comment: Res)
R55  value 330R  [0603]  (hidden comment: Res)
R56  value 47R  [RESMELF3614N]  (hidden comment: Res)
R57  value 47R  [RESMELF3614N]  (hidden comment: Res)
R58  value 10k  [0603]  (hidden comment: Resistor)
R59  value 10k  [0603]  (hidden comment: Resistor)
R60  value 100R  [6-0805_L]  (hidden comment: Resistor)
R61  value 47R  [RESMELF3614N]  (hidden comment: Res)
R62  value 47R  [RESMELF3614N]  (hidden comment: Res)
R63  value 1.5k  [1206]  (hidden comment: Resistor)
R64  value 1.5k  [1206]  (hidden comment: Resistor)
R65  value 47R  [RESMELF3614N]  (hidden comment: Res)
R66  value 47R  [RESMELF3614N]  (hidden comment: Res)
R67  value 330R  [0603]  (hidden comment: Res)
R68  value 330R  [0603]  (hidden comment: Res)
R69  value 330R  [0603]  (hidden comment: Res)
R70  value 330R  [0603]  (hidden comment: Res)
R71  value 330R  [0603]  (hidden comment: Res)
R72  value 330R  [0603]  (hidden comment: Res)
R73  value 2.2k  [0603]  (hidden comment: Resistor)
R74  value 47R  [RESMELF3614N]  (hidden comment: Res)
R75  value 47R  [RESMELF3614N]  (hidden comment: Res)
R76  value 10k  [0603]  (hidden comment: Resistor)
R77  value 10k  [0603]  (hidden comment: Resistor)
R78  value 1.5k  [1206]  (hidden comment: Resistor)
R79  value 1.5k  [1206]  (hidden comment: Resistor)
R80  value 10k  [0603]  (hidden comment: Resistor)
R81  value 10k  [0603]  (hidden comment: Resistor)
R82  value 1.5k  [1206]  (hidden comment: Resistor)
R83  value 1.5k  [1206]  (hidden comment: Resistor)
R84  value 330R  [0603]  (hidden comment: Res)
R85  value 330R  [0603]  (hidden comment: Res)
R86  value 330R  [0603]  (hidden comment: Res)
R87  value 330R  [0603]  (hidden comment: Res)
R88  value 330R  [0603]  (hidden comment: Res)
R89  value 330R  [0603]  (hidden comment: Res)
R90  value 330R  [0603]  (hidden comment: Res)
R91  value 330R  [0603]  (hidden comment: Res)
R93  value 240k  [0603]  (hidden comment: Res)
R94  value 1k  [0603]  (hidden comment: Resistor)
R95  value 100k  [0603]  (hidden comment: Resistor)
R96  value 330R  [0603]  (hidden comment: Res)
R97  value 330R  [0603]  (hidden comment: Res)
R98  value 330R  [0603]  (hidden comment: Res)
R99  value 330R  [0603]  (hidden comment: Res)
R100  value 330R  [0603]  (hidden comment: Res)
R101  value 330R  [0603]  (hidden comment: Res)
R102  value 330R  [0603]  (hidden comment: Res)
R103  value 240k  [0603]  (hidden comment: Res)
R104  value 100k  [0603]  (hidden comment: Resistor)
R105  value 10k  [0603]  (hidden comment: Resistor)
R106  value 240k  [0603]  (hidden comment: Res)
R107  value 100k  [0603]  (hidden comment: Resistor)
R109  value 1.69k  [0603]  (hidden comment: Res)
R110  value 1k  [0603]  (hidden comment: Resistor)
R112  value 10R  [6-0805_L]  (hidden comment: Res)
R113  value 100k  [0603]  (hidden comment: Resistor)
R114  value 3.09k  [0603]  (hidden comment: Res)
R115  value 1k  [0603]  (hidden comment: Resistor)
R116  value 100k  [0603]  (hidden comment: Resistor)
R117  value 10k  [0603]  (hidden comment: Resistor)
R118  value 4.02k  [0603]  (hidden comment: Resistor)
R119  value 10M  [0603]  (hidden comment: Resistor)
R120  value 4.02k  [0603]  (hidden comment: Resistor)
R121  value 7.5k  [0603]  (hidden comment: Resistor)
R122  value 0R  [0402]  (hidden comment: Blob)
R123  value 7.5k  [0603]  (hidden comment: Resistor)
R124  value 4.7k  [0603]  (hidden comment: Res)
R125  value 4.7k  [0603]  (hidden comment: Res)
R126  value 4.7k  [0603]  (hidden comment: Res)
R127  value 7.5k  [0603]  (hidden comment: Res)
R128  value 4.7k  [0603]  (hidden comment: Res)
RT1  Thermistor  [MF72-010D11]
S1  Button Button  [BUTTON]
S2  SW-SPDT  [R_SPDT]  (value not drawn)
U1  Driver  Manufacturer Part Number: MAX4821EUP+  [TSOP65P650X110_HS-20L]
U2  Register  Manufacturer Part Number: MCP23017-E/SS  [SOP65P780X200_HS-28L]
U3  Driver  Manufacturer Part Number: MAX4821EUP+  [TSOP65P650X110_HS-20L]
U4  Register  Manufacturer Part Number: MCP23017-E/SS  [SOP65P780X200_HS-28L]
U5  Driver  Manufacturer Part Number: MAX4821EUP+  [TSOP65P650X110_HS-20L]
U6  DS1338  [SOIC8]
U7  TLP620  [TLP620]
U8  TLP620  [TLP620]
U9  TLP620  [TLP620]
U10  TLP620  [TLP620]
U11  SN74LVC828ADGVR  [24-TFSOP]
U12  CM1293A-04SO  [SC74]
U13  CM1293A-04SO  [SC74]
U14  TLP620  [TLP620]
U15  TLP620  [TLP620]
U16  DS2482S-100  [SOIC8]
U17  CM1293A-04SO  [SC74]
U18  CM1293A-04SO  [SC74]
U19  TLP620  [TLP620]
U20  TLP620  [TLP620]
U21  TLP620  [TLP620]
U22  TLP620  [TLP620]
U25  SN74LVC828ADGVR  [24-TFSOP]
U26  TLC272BCDR  [SO8]
U27  SN74LVC828ADGVR  [24-TFSOP]
U28  LMC660  [SOIC14]
U29  AD5245  [SOT23-8]
U30  74HC4094  [16TSSOP]
U31  AD7993  [16TSSOP]
U32  LM2576  [DDPAK]
U33  LM4132AMF-3.3/NOPB  [SOT23-5]
U34  74HC4094  [16TSSOP]
U35  74HC4040  [16TSSOP]
U36  NSI45060  [DPAK3]
U37  LM2576  [DDPAK]
U38  MAX98306  [TDFN14]
U39  74HC4094  [16TSSOP]
U40  TGS5042  [TGS5042-A00]
VR1  Varistor
VR2  Varistor
VR3  Varistor
VR4  Varistor
VR5  Varistor
VR6  Varistor
VR7  Varistor
VR8  Varistor
VR9  Varistor
VR10  Varistor
VR11  Varistor
VR12  Varistor
VR13  Varistor
VR14  Varistor

## Nets
3.3VCC: C1.1 C2.1 C3.1 C4.1 C5.1 C6.1 C7.2 C15.1 C18.2 C19.2 C26.1 C27.2 C32.2 C33.2 C46.1 C47.1 C57.2 C59.1 C60.2 C66.2 C76.1 C77.1 C78.2 C79.2 C81.2 D29.1(K) D30.1(K) D31.1(K) D32.1(K) L1.2 P1.1 P16.4 R1.1 R2.1 R3.1 R4.1 R9.1 R10.1 R11.2 R12.1 R13.1 R14.1 R15.1 R16.1 R17.1 R18.1 R20.2 R29.1 R30.1 R44.1 R45.1 R58.1 R59.1 R60.1 R76.1 R77.1 R80.1 R81.1 R105.1 R109.1 R117.1 R124.2 R125.2 R126.2 U1.1(VCC) U1.2(/SET) U2.9(VDD) U3.1(VCC) U3.2(/SET) U4.9(VDD) U4.15(A0) U5.1(VCC) U5.2(/SET) U6.8(VCC) U11.24(VCC) U12.5(Vp) U13.5(Vp) U16.1(VCC) U17.5(Vp) U18.5(Vp) U25.24(VCC) U27.24(VCC) U30.15(OE) U30.16(VCC) U31.5(VDD) U31.11(AS) U34.15(OE) U34.16(VCC) U35.16(VCC) U39.15(OE) U39.16(VCC)
5VCC: C8.1 C9.1 C10.2 C40.1 C41.2 C43.2 C51.2 C53.1 C54.1 C55.2 C61.1 C88.1 D3.1(K) F2.2 K1.1 K2.1 K3.1 K4.1 K5.1 K6.1 K7.1 K8.1 K9.1 K10.1 K11.1 K12.1 K13.1 K14.1 K15.1 K16.1 K17.1 K18.1 K19.1 K20.1 K21.1 K22.1 L3.2 LS1.1 P10.1(VCC) P13.1(VCC) P15.1(VCC) P19.3 P22.3 R113.1 R119.1 R127.2 U1.15(COM) U3.15(COM) U5.15(COM) U26.8(VCC) U28.4(VCC) U29.2(VDD) U29.8(A) U33.3(EN) U33.4(VIN) U36.1(A)
AUDIO_5VCC: C85.1 C86.1 C87.2 C91.1 C92.2 L2.2 L3.1 R114.1 U38.11(PVDD) U38.12(PVDD)
GND: BAT1.2 C1.2 C2.2 C3.2 C4.2 C5.2 C6.2 C7.1 C8.2 C9.2 C10.1 C11.2 C12.2 C15.2 C18.1 C19.1 C20.2 C21.2 C26.2 C27.1 C32.1 C33.1 C34.2 C35.2 C38.2 C39.2 C40.2 C41.1 C43.1 C44.2 C46.2 C47.2 C48.2 C49.2 C51.1 C52.1 C53.2 C54.2 C55.1 C56.1 C57.1 C58.1 C59.2 C60.1 C61.2 C64.1 C65.1 C66.1 C67.1 C68.1 C69.1 C70.2 C71.1 C76.2 C77.2 C78.1 C79.1 C81.1 C83.2 C84.1 C85.2 C86.2 C87.1 C88.2 C89.2 C90.2 C91.2 C92.1 C93.2 D1.2(K) D2.2(K) D4.2(K) D5.2(K) D6.2(K) D7.2(K) D8.2(K) D9.2(K) D10.2(K) D11.2(K) D12.2(K) D13.2(K) D14.2(K) D15.2(K) D16.2(K) D17.2(K) D18.2(K) D19.2(K) D20.2(K) D21.2(K) D22.2(K) D23.2(K) D24.2(K) D25.2(K) D26.2(K) D27.2(K) D28.2(K) D33.3(A) D34.3(A) D35.3(A) D36.3(A) J1.1(S) P1.14 P5.6 P5.9 P5.14 P5.20 P5.25 P10.3(GND) P13.3(GND) P15.3(GND) P16.1 P17.2(GND) P18.2(GND) P19.1 P20.2(GND) P22.7 P23.2(GND) P24.2(GND) Q1.3(D) Q6.2(E) Q7.2(E) Q8.2(E) Q10.2(E) R95.2 R104.2 R107.2 R110.1 R112.1 R115.1 R116.2 R121.1 R122.2 R123.1 S2.2 U1.9(GND) U1.12(PGND) U1.18(PGND) U2.10(VSS) U2.15(A0) U2.16(A1) U2.17(A2) U3.9(GND) U3.12(PGND) U3.18(PGND) U4.10(VSS) U4.16(A1) U4.17(A2) U5.9(GND) U5.12(PGND) U5.18(PGND) U6.4(GND) U7.3(EMITTER) U8.3(EMITTER) U9.3(EMITTER) U10.3(EMITTER) U11.1(/OE1) U11.12(GND) U11.13(/OE2) U12.2(Vn) U13.2(Vn) U14.3(EMITTER) U15.3(EMITTER) U16.3(GND) U16.7(AD1) U16.8(AD0) U17.2(Vn) U18.2(Vn) U19.3(EMITTER) U20.3(EMITTER) U21.3(EMITTER) U22.3(EMITTER) U25.1(/OE1) U25.12(GND) U25.13(/OE2) U26.4(GND) U27.1(/OE1) U27.12(GND) U27.13(/OE2) U28.11(GND) U29.3(GND) U29.6(AD0) U29.7(B) U30.8(GND) U31.1(AGND) U31.2(AGND) U31.3(AGND) U31.4(AGND) U31.16(AGND) U32.3(GND) U32.5(/ON) U32.6(_GND) U33.2(GND) U34.8(GND) U35.8(GND) U37.3(GND) U37.5(/ON) U37.6(_GND) U38.1(PGND) U38.8(PGND) U38.15(_GND) U39.8(GND)
A0: U1.6(A0) U2.1(GPB0) U3.6(A0) U5.6(A0)
A1: U1.7(A1) U2.2(GPB1) U3.7(A1) U5.7(A1)
A2: U1.8(A2) U2.3(GPB2) U3.8(A2) U5.8(A2)
ADC2: D32.3(A) R126.1 U28.1(OUT1) U28.2(IN1(-)) U31.9(VIN4)
ADC3: D31.3(A) R125.1 U28.6(IN2(-)) U28.7(OUT2) U31.8(VIN3)
ADC4: D30.3(A) R124.1 U28.8(OUT3) U28.9(IN3(-)) U31.10(VIN2)
ADC_ALR: R117.2 U4.28(GPA7) U31.13(ALR/BUSY)
ADC_CONV: U2.27(GPA6) U31.12(/CONVST)
AUDIO_G: P22.2 P22.4 P22.6 P22.8 U38.5(GAIN)
AUDIO_SHDN: R11.1 U2.28(GPA7) U38.2(/SHDN)
AUX1: K13.6 K13.11 P3.8 R82.1
AUX2: K13.4 K13.13 P4.3 R65.2
C: P21.2(C) RT1.1
C1: C13.1 C14.1 C16.1 C22.1 C24.1 C28.1 C30.1 C36.1 P3.3 P4.8 U7.2(AN/CAT) U8.2(AN/CAT) U9.2(AN/CAT) U10.2(AN/CAT) U14.2(AN/CAT) U15.2(AN/CAT) U19.2(AN/CAT) U20.2(AN/CAT) U21.2(AN/CAT) U22.2(AN/CAT) VR1.1 VR2.1 VR3.1 VR5.1 VR7.1 VR9.1 VR11.1 VR13.1  [also labelled C2]
CO_Aout: C64.2 C65.2 D29.3(A) R118.1 R121.2 U31.7(VIN1)
CO_Dout: R120.1 R123.2 U4.27(GPA6)
COM1: K11.4 K11.13 P7.2 R47.2
COM2: K15.4 K15.13 P8.2 R51.2
COM3: K19.4 K19.13 P9.2 R57.2
COM4: K12.4 K12.13 P11.2 R62.2
COM5: K16.4 K16.13 P12.2 R66.2
COM6: K20.4 K20.13 P14.2 R75.2
COMP1: C11.1 R29.2 U4.1(GPB0) U7.4(COLLECTOR) U11.2(A1)
COMP2: C20.1 R44.2 U4.2(GPB1) U9.4(COLLECTOR) U11.3(A2)
COMP3: C34.1 R58.2 U4.3(GPB2) U11.4(A3) U14.4(COLLECTOR)
COMP4: C38.1 R76.2 U4.4(GPB3) U11.5(A4) U19.4(COLLECTOR)
COMP5: C48.1 R80.2 U4.21(GPA0) U11.6(A5) U21.4(COLLECTOR)
COMP6: C35.1 R59.2 U4.22(GPA1) U11.7(A6) U15.4(COLLECTOR)
COMP7: C39.1 R77.2 U4.23(GPA2) U11.8(A7) U20.4(COLLECTOR)
COMP8: C49.1 R81.2 U4.24(GPA3) U11.9(A8) U22.4(COLLECTOR)
COMP9: C12.1 R30.2 U4.25(GPA4) U8.4(COLLECTOR) U11.10(A9)
COMP10: C21.1 R45.2 U4.26(GPA5) U10.4(COLLECTOR) U11.11(A10)
CS1: R2.2 U1.4(/CS) U2.5(GPB4)
CS2: R10.2 U2.8(GPB7) U3.4(/CS)
CS3: R16.2 U2.23(GPA2) U5.4(/CS)
DB0: P19.2 U30.4(Q1)
DB1: P19.4 U30.5(Q2)
DB2: P19.6 U30.6(Q3)
DB3: P19.8 U30.7(Q4)
DB4: P19.10 U30.14(Q5)
DB5: P19.12 U30.13(Q6)
DB6: P19.14 U30.12(Q7)
DB7: P19.16 U30.11(O8)
DB8: P19.13 U34.4(Q1)
DB9: P19.15 U34.5(Q2)
DB10: P19.17 U34.6(Q3)
DB11: P19.19 U34.7(Q4)
DB12: P19.21 U34.14(Q5)
DB13: P19.23 U34.13(Q6)
DB14: P19.25 U34.12(Q7)
DB15: P19.27 U34.11(O8)
DC: P19.7 U39.14(Q5)
G1: K7.6 K7.11 P3.6 R63.1
G2: K7.4 K7.13 P4.5 R56.2
GPIO4: P5.7 R19.2
Ha: K6.6 K6.11 P6.1 R83.1
Hb: K6.4 K6.13 P6.2 R42.2
HUM: K6.8 K6.9 P6.3
INTA: R31.1 U4.20(INTA)
INTB: R35.1 U4.19(INTB)
LCD_CS: P19.29 U30.1(STROBE) U34.1(STROBE) U35.3(Q5) U39.1(STROBE)
LCD_RST: P19.33 U39.7(Q4)
LED_BL: C93.1 P19.37 Q9.3(C)
LVL1: U1.5(LVL) U2.6(GPB5)
LVL2: U2.21(GPA0) U3.5(LVL)
LVL3: U2.24(GPA3) U5.5(LVL)
NO1: C17.1 K11.8 K11.9 P7.1 VR4.1
NO2: C23.1 K15.8 K15.9 P8.1 VR6.1
NO3: C25.1 K19.8 K19.9 P9.1 VR8.1
NO4: C29.1 K12.8 K12.9 P11.1 VR10.1
NO5: C31.1 K16.8 K16.9 P12.1 VR12.1
NO6: C37.1 K20.8 K20.9 P14.1 VR14.1
OB1: K9.6 K9.11 P3.7 R78.1
OB2: K9.4 K9.13 P4.4 R61.2
OUT1_1: K2.16 U1.16(OUT4)
OUT1_2: K1.16 U1.17(OUT3) U27.2(A1)
OUT1_3: K6.16 U5.20(OUT1) U25.9(A8)
OUT2_1: K5.16 U1.11(OUT7)
OUT2_2: K4.16 U1.14(OUT5) U27.3(A2)
OUT2_3: K3.16 U1.20(OUT1)
OUT3_1: K8.16 U3.16(OUT4)
OUT3_2: K7.16 U3.14(OUT5) U27.4(A3)
OUT3_3: K11.16 U5.10(OUT8) U25.2(A1)
OUT4_1: K10.16 U1.13(OUT6)
OUT4_2: K9.16 U1.19(OUT2) U27.5(A4)
OUT4_3: K15.16 U5.11(OUT7) U25.3(A2)
OUT5_1: K14.16 U3.19(OUT2)
OUT5_2: K13.16 U3.17(OUT3) U27.6(A5)
OUT5_3: K19.16 U5.13(OUT6) U25.4(A3)
OUT6_1: K18.16 U3.11(OUT7)
OUT6_2: K17.16 U3.13(OUT6) U27.7(A6)
OUT6_3: K12.16 U5.14(OUT5) U25.5(A4)
OUT7_1: K22.16 U3.10(OUT8)
OUT7_2: K21.16 U3.20(OUT1) U27.8(A7)
OUT7_3: K16.16 U5.16(OUT4) U25.6(A5)
OUT8_3: K20.16 U5.17(OUT3) U25.7(A6)
P1: P5.3 R23.2 U12.1(CH1)
P2: P5.5 R25.2 U12.3(CH2)
P3: P5.11 R27.2 U12.4(CH3)
P4: P5.13 R31.2 U12.6(CH4)
P5: P5.15 R35.2 U17.1(CH1)
P6: P5.19 R37.2 U17.3(CH2)
P7: P5.21 R39.2 U17.4(CH3)
P8: P5.23 R41.2 U17.6(CH4)
P9: P5.8 R22.1 U13.1(CH1)
P10: P5.10 R24.1 U13.3(CH2)
P11: P5.12 R26.1 U13.4(CH3)
P12: P5.16 R28.1 U13.6(CH4)
P13: P5.18 R32.1 U18.1(CH1)
P14: P5.22 R36.1 U18.3(CH2)
P15: P5.24 R38.1 U18.4(CH3)
P16: P5.26 R40.1 U18.6(CH4)
PWM: Q10.1(B) R26.2
R: F1.1 P21.1(R)
Rc1: K2.8 K2.9 K3.4 K3.13 K5.8 K5.9 K8.8 K8.9 K10.8 K10.9 K14.8 K14.9 P3.2 P4.9 R49.1  [also labelled Rc2]
RD: P19.11 U39.4(Q1)
REG_CS: R38.2 U35.11(Reset)
RELAY_OFF_ST: R3.2 S2.3 U4.5(GPB4) U25.8(A7)
RESET1: D37.3(A) Q6.3(C) R1.2 U1.3(/RESET)
RESET2: D38.3(A) Q7.3(C) R9.2 U3.3(/RESET)
RESET3: D39.3(A) Q8.3(C) R15.2 U5.3(/RESET)
Rh1: K3.8 K3.9 K18.8 K18.9 K22.8 K22.9 P3.1 P4.10 R34.1  [also labelled Rh2]
SCL: P15.5(SCL) P16.3 R25.1 U2.12(SCL) U4.12(SCL) U6.6(SCL) U16.4(SCL) U29.4(SCL) U31.15(SCL)
SDA: P15.4(SDA) P16.2 R23.1 U2.13(SDA) U4.13(SDA) U6.5(SDA) U16.5(SDA) U29.5(SDA) U31.14(SDA)
SPI_MISO: P1.4 P19.26 R39.1
SPI_MOSI: P1.2 P19.22 R37.1 U30.2(IN)
SPI_SCK: P1.6 P19.18 R41.1 U30.3(CLOCK) U34.3(CLOCK) U35.10(Clock) U39.3(CLOCK)
TOUCH_BUSY: P19.24 R19.1
TOUCH_CS: P19.20 R40.2 R105.2
TOUCH_IRQ: P19.28 R32.2
UART_RTS: P1.7 R36.2
UART_RX: P1.3 R24.2
UART_TX: P1.5 R22.2
W1/1: K17.6 K17.11 P3.9 R64.1
W1/2: K21.6 K21.11 P3.10 R79.1
W2/1: K17.4 K17.13 P4.2 R74.2
W2/2: K21.4 K21.13 P4.1 R43.2
WR: P19.9 U39.5(Q2)
Y1/1: K1.6 K1.11 P3.4 R33.1
Y1/2: K4.6 K4.11 P3.5 R48.1
Y2/1: K1.4 K1.13 P4.7 R46.2
Y2/2: K4.4 K4.13 P4.6 R50.2
ZIGBEE_CS: P1.8 R13.2 U4.7(GPB6)
ZIGBEE_INT: P1.11 U4.6(GPB5)
ZigBee_IO: P1.9 R28.2
ZIGBEE_RES: P1.10 R14.2 R27.1
ZIGBEE_WAKE: P1.13 U4.8(GPB7)
NetBAT1_1: BAT1.1 U6.3(VBAT)
NetBQ1_1: BQ1.1 U6.1(X1)
NetBQ1_4: BQ1.4 U6.2(X2)
NetC13_2: C13.2 R42.1 VR1.2
NetC14_2: C14.2 R43.1 VR2.2
NetC16_2: C16.2 R46.1 VR3.2
NetC17_2: C17.2 R47.1 VR4.2
NetC22_2: C22.2 R50.1 VR5.2
NetC23_2: C23.2 R51.1 VR6.2
NetC24_2: C24.2 R56.1 VR7.2
NetC25_2: C25.2 R57.1 VR8.2
NetC28_2: C28.2 R61.1 VR9.2
NetC29_2: C29.2 R62.1 VR10.2
NetC30_2: C30.2 R65.1 VR11.2
NetC31_2: C31.2 R66.1 VR12.2
NetC36_2: C36.2 R74.1 VR13.2
NetC37_2: C37.2 R75.1 VR14.2
NetC42_1: C42.1 R5.1 R94.1 U26.2(IN1_(-))
NetC42_2: C42.2 R5.2 R118.2 U26.1(OUT1) U26.5(IN2_(+))
NetC44_1: C44.1 R6.1 R94.2 R119.2 R122.1 U40.0(W)
NetC52_2: C52.2 R93.1 R95.1 U28.3(IN1(+))
NetC56_2: C56.2 R103.1 R104.1 U28.5(IN2(+))
NetC58_2: C58.2 R106.1 R107.1 U28.10(IN3(+))
NetC67_2: C67.2 C68.2 C69.2 U31.6(REF) U33.5(VREF)
NetC70_1: C70.1 C71.2 C83.1 C84.2 D34.1(K) D35.1(K) P23.1(VCC) P24.1(VCC) U32.1(Vin) U37.1(Vin)
NetC80_1: C80.1 U38.3(INL+)
NetC80_2: C80.2 J1.2(T)
NetC82_1: C82.1 U38.7(INR+)
NetC82_2: C82.2 J1.3(R)
NetC89_1: C89.1 U38.4(INL-)
NetC90_1: C90.1 U38.6(INR-)
NetD1_1: D1.1(A) R7.2
NetD2_1: D2.1(A) R8.2
NetD3_3: D3.3(A) LS1.2 Q1.2(S)
NetD4_1: D4.1(A) R52.1
NetD5_1: D5.1(A) R53.1
NetD6_1: D6.1(A) R54.1
NetD7_1: D7.1(A) R55.1
NetD8_1: D8.1(A) R67.2
NetD9_1: D9.1(A) R68.2
NetD10_1: D10.1(A) R69.2
NetD11_1: D11.1(A) R70.2
NetD12_1: D12.1(A) R71.2
NetD13_1: D13.1(A) R72.2
NetD14_1: D14.1(A) R84.1
NetD15_1: D15.1(A) R85.1
NetD16_1: D16.1(A) R86.1
NetD17_1: D17.1(A) R87.1
NetD18_1: D18.1(A) R88.1
NetD19_1: D19.1(A) R89.1
NetD20_1: D20.1(A) R90.1
NetD21_1: D21.1(A) R91.1
NetD22_1: D22.1(A) R96.2
NetD23_1: D23.1(A) R97.2
NetD24_1: D24.1(A) R100.2
NetD25_1: D25.1(A) R101.2
NetD26_1: D26.1(A) R98.2
NetD27_1: D27.1(A) R99.2
NetD28_1: D28.1(A) R102.2
NetD33_1: D33.1(K) L1.1 U32.2(OUT)
NetD34_2: D34.2(C) F1.2
NetD34_4: D34.4(C) RT1.2
NetD36_1: D36.1(K) L2.1 U37.2(OUT)
NetD37_1: D37.1(K) U2.4(GPB3)
NetD38_1: D38.1(K) U2.7(GPB6)
NetD39_1: D39.1(K) U2.22(GPA1)
NetF2_1: F2.1 P5.2 P5.4
NetK1_8: K1.8 K1.9 K2.4 K2.13
NetK4_8: K4.8 K4.9 K5.4 K5.13
NetK7_8: K7.8 K7.9 K8.4 K8.13
NetK9_8: K9.8 K9.9 K10.4 K10.13
NetK13_8: K13.8 K13.9 K14.4 K14.13
NetK17_8: K17.8 K17.9 K18.4 K18.13
NetK21_8: K21.8 K21.9 K22.4 K22.13
NetP2_1: P2.1 S1.1
NetP2_2: P2.2 S1.2
NetP5_1: P5.1 R20.1
NetP10_2: P10.2(IO) P13.2(IO) Q5.3(D) R73.2 U16.2(IO)
NetP17_1: P17.1(AN) R93.2
NetP18_1: P18.1(AN) R103.2
NetP20_1: P20.1(AN) R106.2
NetP22_1: P22.1 R113.2
NetP22_5: P22.5 R116.1
NetP25_1: P25.1 U38.14(OUTL-)
NetP25_2: P25.2 U38.13(OUTL+)
NetP26_1: P26.1 U38.10(OUTR+)
NetP26_2: P26.2 U38.9(OUTR-)
NetQ1_1: Q1.1(G) R17.2 U6.7(SQW/OUT)
NetQ5_1: Q5.1(G) U16.6(PCTLZ)
NetQ5_2: Q5.2(S) R60.2 R73.1
NetQ6_1: Q6.1(B) Q7.1(B) Q8.1(B) R18.2 S2.1
NetQ9_1: Q9.1(B) R128.1
NetQ9_2: Q9.2(E) U36.4(C)
NetQ10_3: Q10.3(C) R127.1 R128.2
NetR4_2: R4.2 U2.18(/RESET)
NetR6_2: R6.2 U26.3(IN1_(+)) U40.1(C)
NetR7_1: R7.1 U2.25(GPA4)
NetR8_1: R8.1 U2.26(GPA5)
NetR12_2: R12.2 U4.18(/RESET)
NetR33_2: R33.2 U7.1(AN/CAT)
NetR34_2: R34.2 U8.1(AN/CAT)
NetR48_2: R48.2 U9.1(AN/CAT)
NetR49_2: R49.2 U10.1(AN/CAT)
NetR52_2: R52.2 U11.23(Y1)
NetR53_2: R53.2 U11.22(Y2)
NetR54_2: R54.2 U11.21(Y3)
NetR55_2: R55.2 U11.20(Y4)
NetR63_2: R63.2 U14.1(AN/CAT)
NetR64_2: R64.2 U15.1(AN/CAT)
NetR67_1: R67.1 U11.14(Y10)
NetR68_1: R68.1 U11.15(Y9)
NetR69_1: R69.1 U11.16(Y8)
NetR70_1: R70.1 U11.17(Y7)
NetR71_1: R71.1 U11.18(Y6)
NetR72_1: R72.1 U11.19(Y5)
NetR78_2: R78.2 U19.1(AN/CAT)
NetR79_2: R79.2 U20.1(AN/CAT)
NetR82_2: R82.2 U21.1(AN/CAT)
NetR83_2: R83.2 U22.1(AN/CAT)
NetR84_2: R84.2 U25.23(Y1)
NetR85_2: R85.2 U25.22(Y2)
NetR86_2: R86.2 U25.21(Y3)
NetR87_2: R87.2 U25.20(Y4)
NetR88_2: R88.2 U27.23(Y1)
NetR89_2: R89.2 U27.22(Y2)
NetR90_2: R90.2 U27.21(Y3)
NetR91_2: R91.2 U27.20(Y4)
NetR96_1: R96.1 U25.16(Y8)
NetR97_1: R97.1 U25.17(Y7)
NetR98_1: R98.1 U25.18(Y6)
NetR99_1: R99.1 U25.19(Y5)
NetR100_1: R100.1 U27.17(Y7)
NetR101_1: R101.1 U27.18(Y6)
NetR102_1: R102.1 U27.19(Y5)
NetR109_2: R109.2 R110.2 U32.4(FB)
NetR112_2: R112.2 U36.3(R)
NetR114_2: R114.2 R115.2 U37.4(FB)
NetR120_2: R120.2 U26.7(OUT2)
NetU26_6: U26.6(IN2_(-)) U29.1(W)
NetU30_9: U30.9(QS0) U34.2(IN)
NetU34_9: U34.9(QS0) U39.2(IN)

Not connected (* = marked no-connect by the designer): K2 6* 11*; K3 6* 11*; K5 6* 11*; K8 6* 11*; K10 6* 11*; K11 6* 11*; K12 6* 11*; K14 6* 11*; K15 6* 11*; K16 6* 11*; K18 6* 11*; K19 6* 11*; K20 6* 11*; K22 6* 11*; LS2 1 2; LS3 1 2; P1 12*; P5 17*; P19 5* 30* 31* 32* 34* 35* 36* 38* 39* 40*; U1 10(OUT8)*; U2 11(NC)* 14(NC)* 19(INTB)* 20(INTA)*; U4 11(NC)* 14(NC)*; U5 19(OUT2)*; U25 10(A9)* 11(A10)* 14(Y10)* 15(Y9)*; U27 9(A8)* 10(A9)* 11(A10)* 14(Y10)* 15(Y9)* 16(Y8)*; U28 12(IN4(+))* 13(IN4(-))* 14(OUT4); U30 10(QS1)*; U33 1(N/C)*; U34 10(QS1)*; U35 1(Q12)* 2(Q6)* 4(Q7)* 5(Q4)* 6(Q3)* 7(Q2)* 9(Q1)* 12(Q9)* 13(Q8)* 14(Q10)* 15(Q11)*; U39 6(Q3)* 9(QS0)* 10(QS1)* 11(O8)* 12(Q7)* 13(Q6)*

## Notes on the sheet
- CHANGES
- (near U2) I2C = 0100000b
- HTU21 = 1000000b
- Reg1 = 0100000b
- Reg2 = 0100001b
- ADC = 0100010b
- 1-Wire  = 0011000b
- Res2  = 0101101b
- Res1  = 0101100b
- (near U4) I2C = 0100001b
- ZigBee connector
- 3V3
- (near P5) SDA/GPIO2
- (near P5) SCL/GPIO3
- (near P5) GPIO4
- (near P5) 5V
- (near P5) GND
- (near P5) GPIO14/TxD
- GND
- (near P5) GPIO17-RTS
- (near P5) GPIO27
- (near P5) GPIO22
- (near P5) GPIO15/RxD
- (near P5) GPIO18/PWM
- (near P5) GPIO23
- (near P5) GPIO24
- (near P5) MOSI/GPIO10
- (near P5) MISO/GPIO9
- (near P5) CLK/GPIO11
- (near P5) GPIO8/CE0
- (near P5) GPIO7/CE1
- (near P5) GPIO5
- B
- G
- (near U16) I2C  = 0011000b
- Y
- R
- O
- (near R94) CHANGES
- (near P16) I2C = 1000000b
- (near U29) I2C  = 0101100b
- VCC
- (near P19) TFT
- (near P19) LCD_DB0
- (near P19) LCD_DB1
- (near P19) LCD_DB8
- (near P19) LCD_RD
- (near P19) LCD_WR
- (near P19) LCD_RS
- NC
- (near P19) LCD_DB2
- (near P19) LCD_DB3
- (near P19) LCD_DB4
- (near P19) LCD_DB5
- (near P19) LCD_DB6
- (near P19) LCD_DB9
- (near P19) LCD_DB11
- (near P19) LCD_DB12
- (near P19) LCD_DB13
- (near P19) LCD_DB10
- (near P19) LCD_DB7
- (near P19) TouchP_CLK
- (near P19) TouchP _CS
- (near P19) TouchP _DIN
- (near P19) TouchP _BUSY
- (near P19) LCD_DB14
- (near P19) LCD_DB15
- (near P19) LCD_CS
- (near P19) LCD_RESET
- (near P19) TouchP _OUT
- (near P19) TouchP _Penirq
- (near P19) SD_OUT
- (near P19) SD_SCK
- (near P19) SD_DIN
- (near P19) LED_BL
- (near P19) SD_CS
- (near P19) NC
- (near U31) ADC = 0100010b
- (near P22) No jumper = 6dB
- 1-2 = 9dB
- 3-4 = 12dB
- 5-6 = 15dB
- 7-8 = 18dB
- V 1.18
- (in symbol Res Thermal) t°

## Library data of the parts
BAT1 = Battery: Battery holder; Manufacturer Part Number: BH32T-C; Manufacturer: MPD (Memory Protection Devices); Mount: 1
BQ1 = 6LC:308C: CRYSTAL 32.768KHZ 12.5PF SMD; Manufacturer Part Number: ABS25-32.768KHZ-T; Manufacturer: Abracon Corporation; Mount: 1
C1-C6 C8 C9 C11 C12 C15 C20 C21 C26 C34 C35 C38-C40 C46-C49 C53 C54 C59 C61 C91 C93 = Cap: CAP CER 10UF 10V 20% X5R 0805; Manufacturer Part Number: C2012X5R1A106M125AB; Manufacturer: TDK Corporation
  C1-C6 C9 C11 C12 C15 C20 C21 C26 C34 C35 C38-C40 C46-C49 C53 C54 C59 C61 C91 C93: Mount: 1
  C8: Mount: 0
C7 C10 C27 C41 C51 C55 C57 C60 C66 C78 C79 C81 C87 C92 = Cap: CAP CER 0.1UF 50V Y5V 0603; Manufacturer Part Number: CC0603ZRY5V9BB104; Manufacturer: Yageo; Mount: 1
C13 C14 C16 C17 C22-C25 C28-C31 C36 C37 = Cap: CAP FILM 0.1UF 250VDC RADIAL; Manufacturer: EPCOS Inc; Manufacturer Part Number: B32521C3104K; Mount: 0
C18 C19 C32 C33 = Cap: CAP CER 0.22UF 50V 10% X7R 0603; Manufacturer Part Number: C1608X7R1H224K080AB; Manufacturer: TDK Corporation; Mount: 1
C42 C44 = Cap: CAP CER 22UF 6.3V 10% X5R 0603; Manufacturer Part Number: CL10A226KQ8NRNE; Manufacturer: Samsung Electro-Mechanics America, Inc
  C42: Mount: 1
  C44: Mount: 0
C43 C52 C56 C58 C64 = Cap: CAP CER 100PF 100V 5% NP0 0603; Manufacturer Part Number: CL10C101JC81PNC; Manufacturer: Samsung Electro-Mechanics America, Inc; Mount: 1
C65 C67 = Cap: CAP CER 10PF 50V NP0 0603; Manufacturer Part Number: CL10C100CB81PNC; Manufacturer: Samsung Electro-Mechanics America, Inc; Mount: 1
C68 C80 C82 C89 C90 = Cap: CAP CER 1UF 10V 10% X5R 0603; Manufacturer Part Number: C0603C105K8PACTU; Manufacturer: Kemet; Mount: 1
C69 = Cap: CAP CER 0.1UF 50V 10% X7R 0603; Manufacturer Part Number: CL10B104KB8SFNC; Manufacturer: Samsung Electro-Mechanics America, Inc; Mount: 1
C70 C83 = CAP0810Alu: CAP ALUM 220UF 50V 20% SMD; Manufacturer Part Number: EEE-FT1H221AP; Manufacturer: Panasonic Electronic Components; Value: 220uF; Mount: 1
C71 C84 = Cap: CAP CER 0.1UF 100V 10% X7R 1206; Manufacturer Part Number: CC1206KKX7R0BB104; Manufacturer: Yageo; Mount: 1
C76 C77 C85 C86 = CAP0810Alu: CAP ALUM 470UF 16V 20% SMD; Manufacturer Part Number: EEE-FP1C471AP; Manufacturer: Panasonic Electronic Components; Value: 470uF; Mount: 1
C88 = CAP0810Alu: CAP ALUM 100UF 35V 20% SMD; Manufacturer Part Number: EEE-FP1V101AP; Manufacturer: Panasonic Electronic Components; Value: 100uF; Mount: 1
D1 D11 D12 D23-D25 = LED0: LED RED CLEAR 0603 SMD; Manufacturer Part Number: LTST-C190EKT; Manufacturer: Lite-On Inc; Mount: 1
D2 D6 D10 D20 D22 = LED0: LED GREEN CLEAR THIN 0603 SMD; Manufacturer Part Number: LTST-C191KGKT; Manufacturer: Lite-On Inc; Mount: 1
D3 D29-D33 D36 = Diode 10TQ035: DIODE SCHOTTKY 100V 1A 1206; Manufacturer Part Number: SD1206S100S1R0; Manufacturer: AVX Corporation
  D3: Mount: 0
  D29-D33 D36: Mount: 1
D4 D5 D7 D13 D18 D19 D21 D28 = LED0: LED BLUE CLEAR THIN 0603 SMD; Manufacturer Part Number: LTST-C191TBKT; Manufacturer: Lite-On Inc; Mount: 1
D8 D9 = LED0: LED YELLOW CLEAR THIN 0603 SMD; Manufacturer Part Number: LTST-C191KSKT; Manufacturer: Lite-On Inc; Mount: 1
D14-D17 D26 D27 = LED0: LED  ORAN CLR THIN 0603 SMD; Manufacturer Part Number: LTST-C191KFKT; Manufacturer: Lite-On Inc; Mount: 1
D34 = Bridge1: BRIDGE RECTIFIER 100V 2A MBS2; Manufacturer: Comchip Technology; Manufacturer Part Number: CDBHM2100L-HF; Mount: 1
D35 = Diode 10TQ035: TVS DIODE 51VWM 82.4VC SMB; Manufacturer Part Number: SMBJ51A; Manufacturer: Fairchild Semiconductor; Mount: 1
D37-D39 = Diode 10TQ035: DIODE SCHOTTKY 40V 0.03A 0603; Manufacturer Part Number: CDBU00340; Manufacturer: Comchip Technology; Mount: 1
F1 F2 = Fuse 2: FUSE 2A 63V 1206 SLOW C1S; Manufacturer Part Number: C1S 2; Manufacturer: Bel Fuse Inc; Mount: 1
J1 = Phonejack3: CONN JACK STEREO 3POS 3.5MM SMD; Manufacturer Part Number: SJ1-3513-SMT-TR; Manufacturer: CUI Inc; Mount: 1
K1-K22 = az8222: 5V 2A Relay; Manufacturer Part Number: AZ8222–2C–5DME; Manufacturer: American Zettler; Mount: 1
L1 L2 = Inductor: INDUCTOR PWR TOROID 100UH T/H; Manufacturer Part Number: PE-92108KNL; Manufacturer: Pulse Electronics Corporation; Mount: 1
L3 = Inductor: INDUCTOR 20UH 2.6A 8095 RAD; Manufacturer Part Number: 744772200; Manufacturer: Wurth Electronics Inc; Mount: 1
LS1 = Speaker: BUZZER PIEZO 12V 13.7MM RADIAL; Manufacturer: CUI Inc; Published: 24-Mar-1999; LatestRevisionDate: 17-Jul-2002; LatestRevisionNote: Re-released for DXP Platform.; PackageReference: PIN2; Publisher: Altium Limited; Manufacturer Part Number: CEP-2242; Mount: 0
LS2 LS3 = Speaker: SPEAKER 8OHM 1W 80DB 28MM; Manufacturer Part Number: AS02808MR-R; Manufacturer: PUI Audio, Inc.; Published: 24-Mar-1999; LatestRevisionDate: 17-Jul-2002; LatestRevisionNote: Re-released for DXP Platform.; PackageReference: PIN2; Publisher: Altium Limited; Mount: 1
P1 = Header 7X2: CONN FEMALE 14POS DL .1" TIN SMD; Manufacturer Part Number: NPTC072KFMS-RC; Manufacturer: Sullins Connector Solutions; Mount: 1
P2 = Header 2: CONN HDR BRKWAY .100 2POS VERT; Manufacturer Part Number: 5-146274-2; Manufacturer: TE Connectivity; Mount: 1
P3 P4 = Header 10: TERM BLOCK HDR 10POS R/A 5.08MM; Manufacturer Part Number: 20020109-H101A01LF; Manufacturer: FCI; Mount: 1
P5 = Header 13X2: CONN HEADER 26POS .100 STR 30AU; Manufacturer Part Number: 68602-126HLF; Manufacturer: FCI; Mount: 1
P6 = Header 3: Header, 3-Pin; Manufacturer Part Number: 1759020; Manufacturer: Phoenix Contact; Mount: 1
P7-P9 P11 P12 P14 P17 P18 P20 P21 P23 P24 = Header 2: TERM BLOCK HDR 2POS R/A 5.08MM; Manufacturer Part Number: 1759017; Manufacturer: Phoenix Contact; Mount: 1
P10 P13 = Header 3: CONN MOD JACK R/A 6P6C; Manufacturer Part Number: 5555165-1; Manufacturer: TE Connectivity; LatestRevisionDate: 17-Jul-2002; LatestRevisionNote: Re-released for DXP Platform.; Publisher: Altium Limited; Mount: 1
P15 = Header 4: CONN MOD JACK R/A 6P6C; Manufacturer Part Number: 5555165-1; Manufacturer: TE Connectivity; Mount: 1
P16 = Header 4: CONN HEADER .050" 4POS PCB R/A; Manufacturer Part Number: GRPB041VWCN-RC; Manufacturer: Sullins Connector Solutions; Mount: 1
P19 = Header 20X2: CONN FMALE 40POS DL .1" GOLD SMD; Manufacturer Part Number: NPPC202KFMS-RC; Manufacturer: Sullins Connector Solutions; Mount: 1
P22 = Header 4X2: CONN HEADER 8POS .100" VERT TIN; Manufacturer Part Number: 0015912080; Manufacturer: Molex Inc; Mount: 1
P25 P26 = Header 2: CONN HEADER VERT 2POS .100 TIN; Manufacturer: TE Connectivity; Mount: 1
Q1 Q5 = IRLML6302: HEXFET Power MOSFET; Manufacturer: International Rectifier; Published: 8-Jun-2000; LatestRevisionDate: 20-Nov-2009; LatestRevisionNote: IPC-7351 Footprint Added.; DatasheetVersion: Aug-1997; PackageReference: SOT-23; Publisher: Altium Limited; PackageDescription: 3-Pin SOT-23 Package 0.95 mm Pitch, 2.3 mm Lead Span; ComponentLink1Description: Manufacturer Link; ComponentLink1URL: http://www.irf.com/; ComponentLink2Description: Datasheet; ComponentLink2URL: http://www.irf.com/product-info/datasheets/data/irlml6302.pdf; Manufacturer Part Number: IRLML6302GTRPBF
  Q1: Mount: 0
  Q5: Mount: 1
Q6-Q8 Q10 = 2N3904: TRANSISTOR NPN 40V 200MA SOT-23; Manufacturer: Fairchild Semiconductor; Manufacturer Part Number: KST3904MTF; Mount: 1
Q9 = 2N3906: IC AMP PNP 40V 200MA SOT-23; Manufacturer: Fairchild Semiconductor; Mount: 1; Manufacturer Part Number: BSR18A
R1-R4 R9-R18 R29 R30 R44 R45 R58 R59 R76 R77 R80 R81 R105 = Res3: RES 10K OHM 1/10W 5% 0603 SMD; Manufacturer Part Number: RC0603JR-0710KL; Manufacturer: Yageo
  R1-R4 R9-R16 R18 R29 R30 R44 R45 R58 R59 R76 R77 R80 R81 R105: Mount: 1
  R17: Mount: 0
R5 = Res3: RES 1M OHM 1/10W 1% 0603 SMD; Manufacturer Part Number: ERJ-3EKF1004V; Manufacturer: Panasonic Electronic Components; Mount: 1
R6 R94 R110 R115 = Res3: RES 1K OHM 1/10W 1% 0603; Manufacturer Part Number: RC1608F102CS; Manufacturer: Samsung Electro-Mechanics America, Inc; Mount: 1
R7 R8 R52-R55 R67-R72 R84-R91 R96-R102 = Res3: RES 330 OHM 1/10W 5% 0603; Manufacturer Part Number: RC1608J331CS; Manufacturer: Samsung Electro-Mechanics America, Inc; Mount: 1
R19 R22-R28 R31 R32 R35-R41 R112 = Res3: RES 10 OHM 1/8W 5% 0805; Manufacturer Part Number: RC2012J100CS; Manufacturer: Samsung Electro-Mechanics America, Inc
  R19 R22-R28 R31 R32 R35-R41: Mount: 1
  R112: Mount: 0
R20 = Res3: RES 0.0 OHM 1/4W JUMP 1206; Manufacturer Part Number: RC3216J000CS; Manufacturer: Samsung Electro-Mechanics America, Inc; Mount: 0
R33 R34 R48 R49 R63 R64 R78 R79 R82 R83 = Res3: RES 1.5K OHM 1/4W 5% 1206; Manufacturer Part Number: RC3216J152CS; Manufacturer: Samsung Electro-Mechanics America, Inc; Mount: 1
R42 R43 R46 R47 R50 R51 R56 R57 R61 R62 R65 R66 R74 R75 = Res3: RES 47 OHM .4W 2% 0204 MELF; Manufacturer Part Number: CMA02040X4709GB300; Manufacturer: Vishay Beyschlag; Mount: 1
R60 = Res3: RES 100 OHM 1/8W 5% 0805; Manufacturer Part Number: RC2012J101CS; Manufacturer: Samsung Electro-Mechanics America, Inc; Mount: 1
R73 = Res3: RES 2.2K OHM 1/10W 5% 0603; Manufacturer Part Number: RC1608J222CS; Manufacturer: Samsung Electro-Mechanics America, Inc; Mount: 0
R93 R103 R106 = Res3: RES 240K OHM 1/10W 1% 0603; Manufacturer Part Number: RC1608F244CS; Manufacturer: Samsung Electro-Mechanics America, Inc; Mount: 1
R95 R104 R107 = Res3: RES 100K OHM 1/10W 1% 0603; Manufacturer Part Number: RC1608F104CS; Manufacturer: Samsung Electro-Mechanics America, Inc; Mount: 1
R109 = Res3: RES 1.69K OHM 1/10W 1% 0603; Manufacturer Part Number: RC1608F1691CS; Manufacturer: Samsung Electro-Mechanics America, Inc; Mount: 1
R113 R116 = Res3: RES 100K OHM 1/10W 5% 0603; Manufacturer Part Number: RC1608J104CS; Manufacturer: Samsung Electro-Mechanics America, Inc; Mount: 1
R114 = Res3: RES 3.09K OHM 1/10W 1% 0603 SMD; Manufacturer Part Number: CRCW06033K09FKEA; Manufacturer: Vishay Dale; Mount: 1
R117 = Res3: RES 10K OHM 1/10W 1% 0603; Manufacturer Part Number: RC1608F103CS; Manufacturer: Samsung Electro-Mechanics America, Inc; Mount: 1
R118 R120 = Res3: RES 4.02K OHM 1/10W 1% 0603; Manufacturer Part Number: RC1608F4021CS; Manufacturer: Samsung Electro-Mechanics America, Inc; Mount: 1
R119 = Res3: RES 10M OHM 1/10W 5% 0603; Manufacturer Part Number: RC1608J106CS; Manufacturer: Samsung Electro-Mechanics America, Inc; Mount: 0
R121 R123 R127 = Res3: RES 7.5K OHM 1/10W 5% 0603; Manufacturer Part Number: RC1608J752CS; Manufacturer: Samsung Electro-Mechanics America, Inc; Mount: 1
R122 = Res3: RES 0.0 OHM 1/10W JUMP 0402 SMD; Manufacturer Part Number: ERJ-2GE0R00X; Manufacturer: Panasonic Electronic Components; Mount: 1
R124-R126 R128 = Res3: RES 4.7K OHM 1/10W 1% 0603; Manufacturer Part Number: RC1608F472CS; Manufacturer: Samsung Electro-Mechanics America, Inc; Mount: 1
RT1 = Res Thermal: CURRENT LIMITER INRUSH 10OHM 20%; Manufacturer: Cantherm; Manufacturer Part Number: MF72-010D11; Mount: 1
S1 = SW-PB: SWITCH TACTILE SPST-NO 0.05A 12V; Manufacturer Part Number: FSMRA4JH; Manufacturer: TE Connectivity; Mount: 1
S2 = SW-SPDT: SWITCH ROCKER SPDT 5A 120V; Manufacturer Part Number: 300SP1J1BLKM6QE; Manufacturer: E-Switch; Mount: 1
U1 U3 U5 = MAX4821: 3.3V/+5V, 8-Channel, Cascadable Relay Drivers  with Serial/Parallel Interface; Manufacturer: Maxim Integrated; Mount: 1
U2 U4 = MCP23017: 16-Bit I/O Expander with Serial Interface; Manufacturer: Microchip Technology; Mount: 1
U6 = DS1338: IC RTC CLK/CALENDAR I2C 8-SOIC; Manufacturer Part Number: DS1338Z-33+T&R; Manufacturer: Maxim Integrated; Mount: 1
U7-U10 U14 U15 U19-U22 = TLP620: OPTOCOUPLER TRANS 5KVRMS 4DIP; Manufacturer Part Number: TLP620(F); Manufacturer: Toshiba Semiconductor and Storage; Mount: 1
U11 U25 U27 = SN74LVC828ADGVR: IC INVERTER 10-INPUT 24TSSOP; Manufacturer Part Number: SN74LVC828APWR; Manufacturer: Texas Instruments; Mount: 1
U12 U13 U17 U18 = CM1293A: TVS DIODE 3.3VWM 9.9VC SC74; Manufacturer: ON Semiconductor; Manufacturer Part Number: CM1293A-04SO; Mount: 1
U16 = DS2482S-100: IC I2C TO 1WIRE BRIDGE 8SOIC; Manufacturer Part Number: DS2482S-100+T&R; Manufacturer: Maxim Integrated; Mount: 1
U26 = LMC662: IC OPAMP GP 2.2MHZ 8SOIC; Manufacturer: Texas Instruments; Mount: 1; Manufacturer Part Number: TLC272BCDR
U28 = LMC660: IC OPAMP GP 1.4MHZ RRO 14SOIC; Manufacturer Part Number: LMC660AIMX/NOPB; Manufacturer: Texas Instruments; Mount: 1
U29 = AD5245: IC DGTL POT 256POS SOT23-8; Manufacturer Part Number: AD5245BRJZ10-R2; Manufacturer: Analog Devices Inc; Mount: 1
U30 U34 U39 = 74HC4094: IC SHIFT LATCH REG SIPO 16-TSSOP; Manufacturer Part Number: M74HC4094TTR; Manufacturer: STMicroelectronics; Mount: 1
U31 = AD7993: IC ADC 10BIT 4CH W/I2C 16-TSSOP; Manufacturer Part Number: AD7993BRUZ-0; Manufacturer: Analog Devices Inc; Mount: 1
U32 U37 = LM2576HVSX-5.0: IC REG BUCK 3A TO263-5; Manufacturer Part Number: LM2576HVSX-ADJ/NOPB; Manufacturer: Texas Instruments; Mount: 1
U33 = LM4132AMF-3.3/NOPB: IC VREF SERIES PREC 3.3V SOT23-5; Manufacturer Part Number: LM4132EMF-3.3/NOPB; Manufacturer: Texas Instruments; Mount: 1
U35 = 74HC4040: IC COUNTER 12STAGE BIN 16-TSSOP; Manufacturer Part Number: MC74HC4040ADTR2G; Manufacturer: ON Semiconductor; Mount: 1
U36 = NSI45060: IC LED DRVR SBT CCR DPAK; Manufacturer Part Number: NSI45060JDT4G; Manufacturer: ON Semiconductor; Mount: 1
U38 = MAX98306: IC AMP AUDIO 3.7W STER D 14TDFN; Manufacturer Part Number: MAX98306ETD+T; Manufacturer: Maxim Integrated; Mount: 1
U40 = TGS5042: Technical Information for Carbon Monoxide Sensors; Manufacturer: Figaro; Manufacturer Part Number: TGS5042-A00; Mount: 1
VR1-VR14 = Res Varistor: VARISTOR 61V 250A DISC 5MM; Manufacturer Part Number: ERZ-V05D680; Manufacturer: Panasonic Electronic Components; Mount: 1